# EAGLE schematic FindMeSAT_MB_1V2 (EAGLE 7.7.0)

## Sheet 1 of 12: CPU
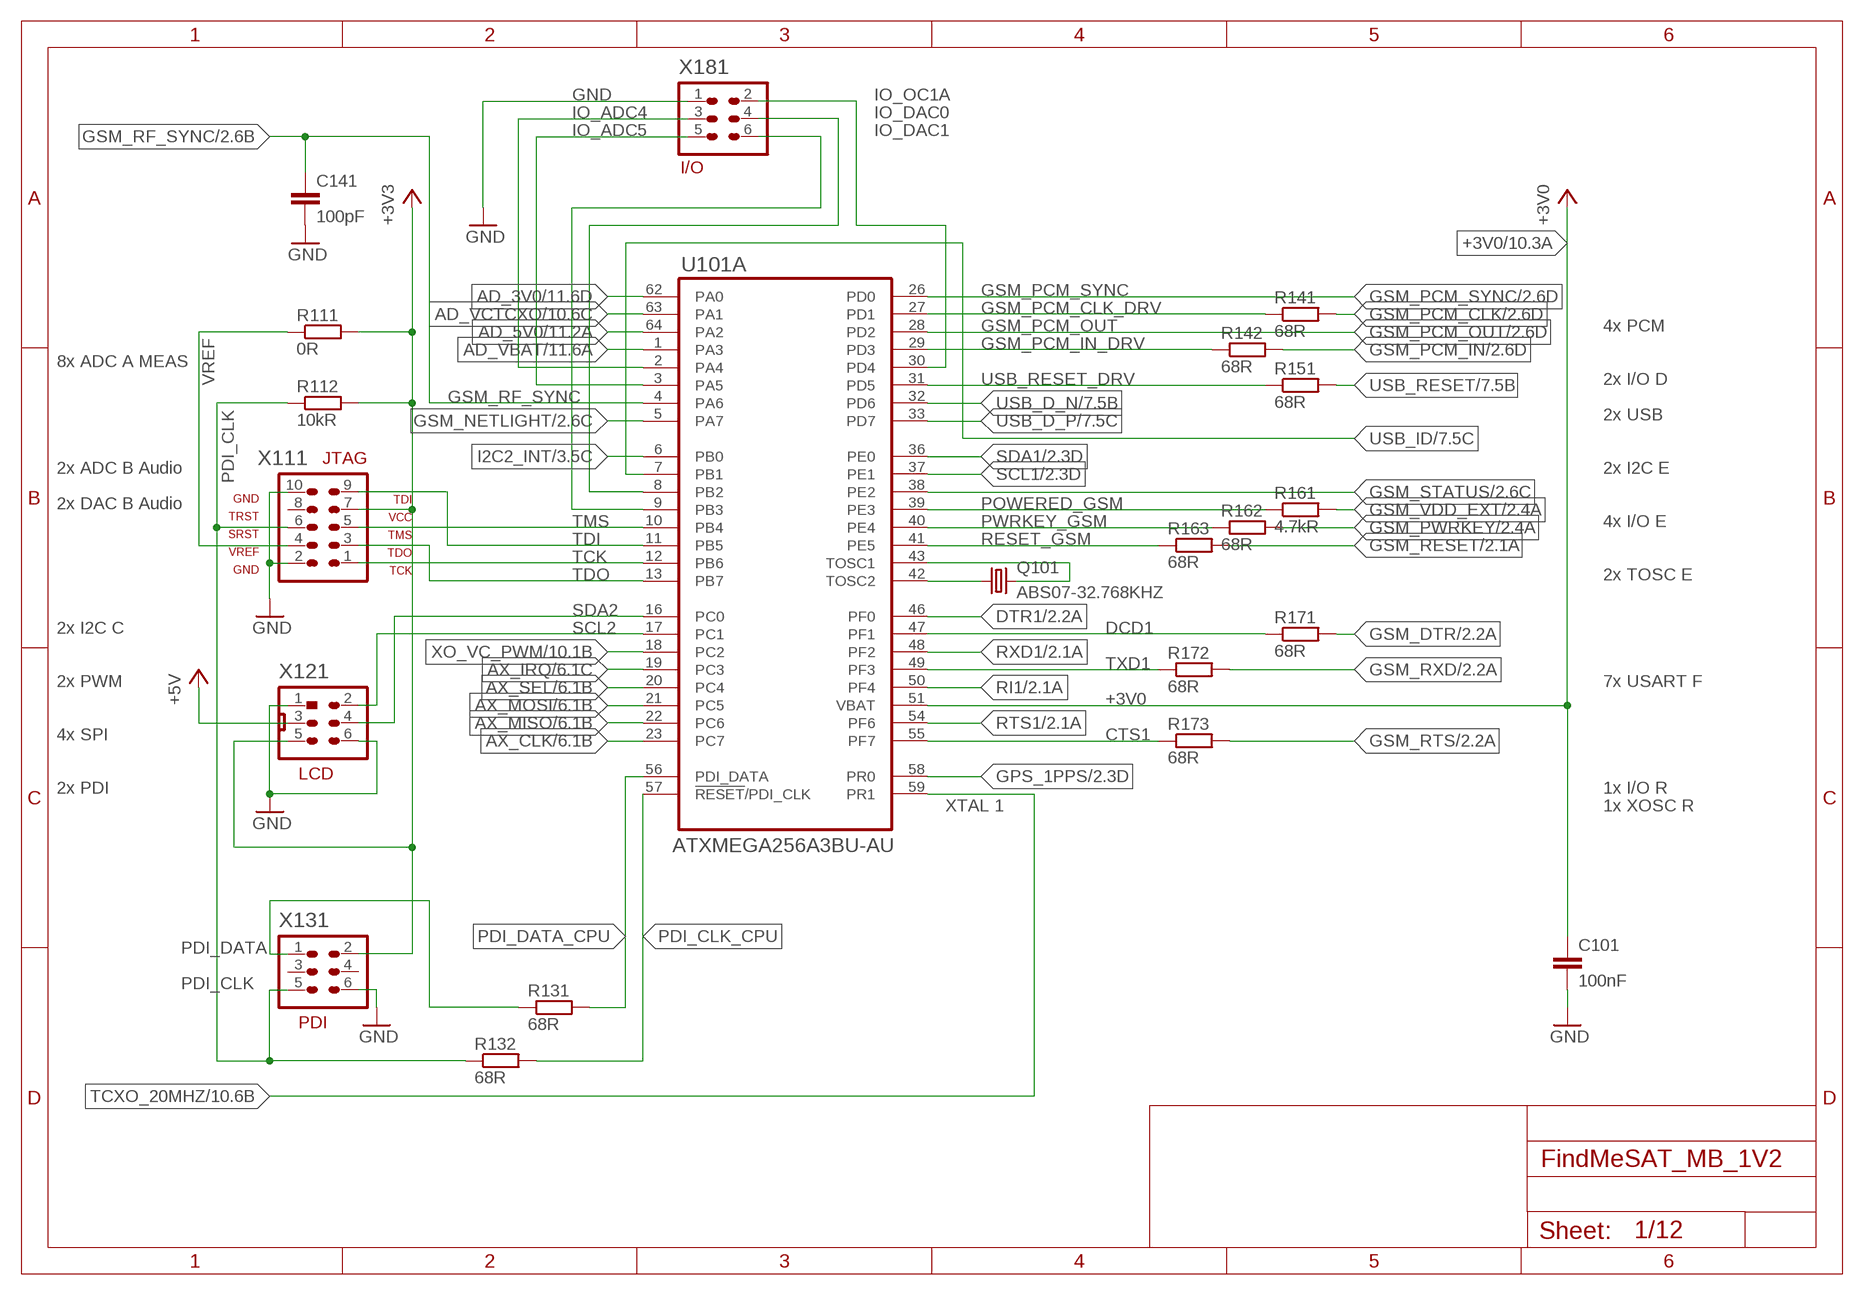
[diagram p0: schematic, sheet 1]

### Parts
C101  100nF  C-EUC0603  [C0603]
C141  100pF  C-EUC0603  [C0603]
Q101  ABS07-32.768KHZ  [ABS07]
R111  0R  R-EU_R0805  [R0805]
R112  10kR  R-EU_R0603  [R0603]
R131  68R  R-EU_R0603  [R0603]
R132  68R  R-EU_R0603  [R0603]
R141  68R  R-EU_R0603  [R0603]
R142  68R  R-EU_R0603  [R0603]
R151  68R  R-EU_R0603  [R0603]
R161  4.7kR  R-EU_R0603  [R0603]
R162  68R  R-EU_R0603  [R0603]
R163  68R  R-EU_R0603  [R0603]
R171  68R  R-EU_R0603  [R0603]
R172  68R  R-EU_R0603  [R0603]
R173  68R  R-EU_R0603  [R0603]
U101  ATXMEGA256A3BU-AU  [QFP80P1600X1600X120-64N]
X111  AVR-JTAG-10  [2X05]
X121  MOLEX_90130_2X03  [MOLEX_90130_2X03]
X131  HEADER-2X3  [2X03]
X181  HEADER-2X3  [2X03]

### Nets
+3V0: C101.1 U101.51(A:VBAT) ; also sheet 2,10,11
+3V3 [+3V3]: R111.2 R112.2 X111.7 X121.5 X131.2 ; also sheet 2,3,4,5,6,10,11
+5V [pwrA5]: X121.3 ; also sheet 2,7,11
AD_3V0: U101.62(A:PA0) ; also sheet 11
AD_5V0: U101.64(A:PA2) ; also sheet 11
AD_VBAT: U101.1(A:PA3) ; also sheet 11
AD_VCTCXO: U101.63(A:PA1) ; also sheet 10
AX_CLK [R110_SPI]: U101.23(A:PC7) ; also sheet 6
AX_IRQ [R110_SPI]: U101.19(A:PC3) ; also sheet 6
AX_MISO [R110_SPI]: U101.22(A:PC6) ; also sheet 6
AX_MOSI [R110_SPI]: U101.21(A:PC5) ; also sheet 6
AX_SEL [R110_SPI]: U101.20(A:PC4) ; also sheet 6
CTS1: R173.1 U101.55(A:PF7)
DCD1: R171.1 U101.47(A:PF1)
DTR1: U101.46(A:PF0) ; also sheet 2
GND [GND]: C101.2 C141.2 X111.2 X111.10 X121.1 X121.6 X131.6 X181.1 ; also sheet 2,3,4,5,6,7,8,9,10,11,12
GPS_1PPS: U101.58(A:PR0) ; also sheet 2
GSM_DTR: R171.2 ; also sheet 2
GSM_NETLIGHT: U101.5(A:PA7) ; also sheet 2
GSM_PCM_CLK: R141.2 ; also sheet 2
GSM_PCM_CLK_DRV: R141.1 U101.27(A:PD1)
GSM_PCM_IN: R142.2 ; also sheet 2
GSM_PCM_IN_DRV: R142.1 U101.29(A:PD3)
GSM_PCM_OUT: U101.28(A:PD2) ; also sheet 2
GSM_PCM_SYNC: U101.26(A:PD0) ; also sheet 2
GSM_PWRKEY: R162.2 ; also sheet 2
GSM_RESET: R163.2 ; also sheet 2
GSM_RF_SYNC: C141.1 U101.4(A:PA6) ; also sheet 2
GSM_RTS: R173.2 ; also sheet 2
GSM_RXD: R172.2 ; also sheet 2
GSM_STATUS: U101.38(A:PE2) ; also sheet 2
GSM_VDD_EXT: R161.2 ; also sheet 2
I2C2_INT: U101.6(A:PB0) ; also sheet 3
IO_ADC4: U101.2(A:PA4) X181.3
IO_ADC5: U101.3(A:PA5) X181.5
IO_DAC0: U101.8(A:PB2) X181.4
IO_DAC1: U101.9(A:PB3) X181.6
IO_OC1A: U101.30(A:PD4) X181.2
PDI_CLK: R112.1 R132.1 X111.6 X131.5
PDI_CLK_CPU: R132.2 U101.57(A:!RESET!/PDI_CLK)
PDI_DATA: R131.1 X131.1
PDI_DATA_CPU: R131.2 U101.56(A:PDI_DATA)
POWERED_GSM: R161.1 U101.39(A:PE3)
PWRKEY_GSM: R162.1 U101.40(A:PE4)
RESET_GSM: R163.1 U101.41(A:PE5)
RI1: U101.50(A:PF4) ; also sheet 2
RTS1: U101.54(A:PF6) ; also sheet 2
RXD1: U101.48(A:PF2) ; also sheet 2
SCL1: U101.37(A:PE1) ; also sheet 2,3,4,5
SCL2: U101.17(A:PC1) X121.2
SDA1: U101.36(A:PE0) ; also sheet 2,3,4,5
SDA2: U101.16(A:PC0) X121.4
TCK: U101.12(A:PB6) X111.1
TCXO_20MHZ: U101.59(A:PR1) ; also sheet 10
TDI: U101.11(A:PB5) X111.9
TDO: U101.13(A:PB7) X111.3
TMS: U101.10(A:PB4) X111.5
TOSC1: Q101.2 U101.43(A:TOSC1)
TOSC2: Q101.1 U101.42(A:TOSC2)
TXD1: R172.1 U101.49(A:PF3)
USB_D_N [R90_USB]: U101.32(A:PD6) ; also sheet 7
USB_D_P [R90_USB]: U101.33(A:PD7) ; also sheet 7
USB_ID: U101.7(A:PB1) ; also sheet 7
USB_RESET: R151.2 ; also sheet 7
USB_RESET_DRV: R151.1 U101.31(A:PD5)
VREF: R111.1 X111.4
XO_VC_PWM: U101.18(A:PC2) ; also sheet 10
Unconnected: X111.8 X131.3 X131.4

### Notes on the sheet
- I/O
- 4x PCM
- 8x ADC A MEAS
- 2x I/O D
- 2x USB
- 2x ADC B Audio | 2x I2C E
- 2x DAC B Audio
- 4x I/O E
- 2x TOSC E
- 2x I2C C
- 2x PWM | 7x USART F
- 4x SPI
- LCD
- 2x PDI | 1x I/O R
- XTAL 1 | 1x XOSC R
- PDI

## Sheet 2 of 12: GSM_GPS_BT
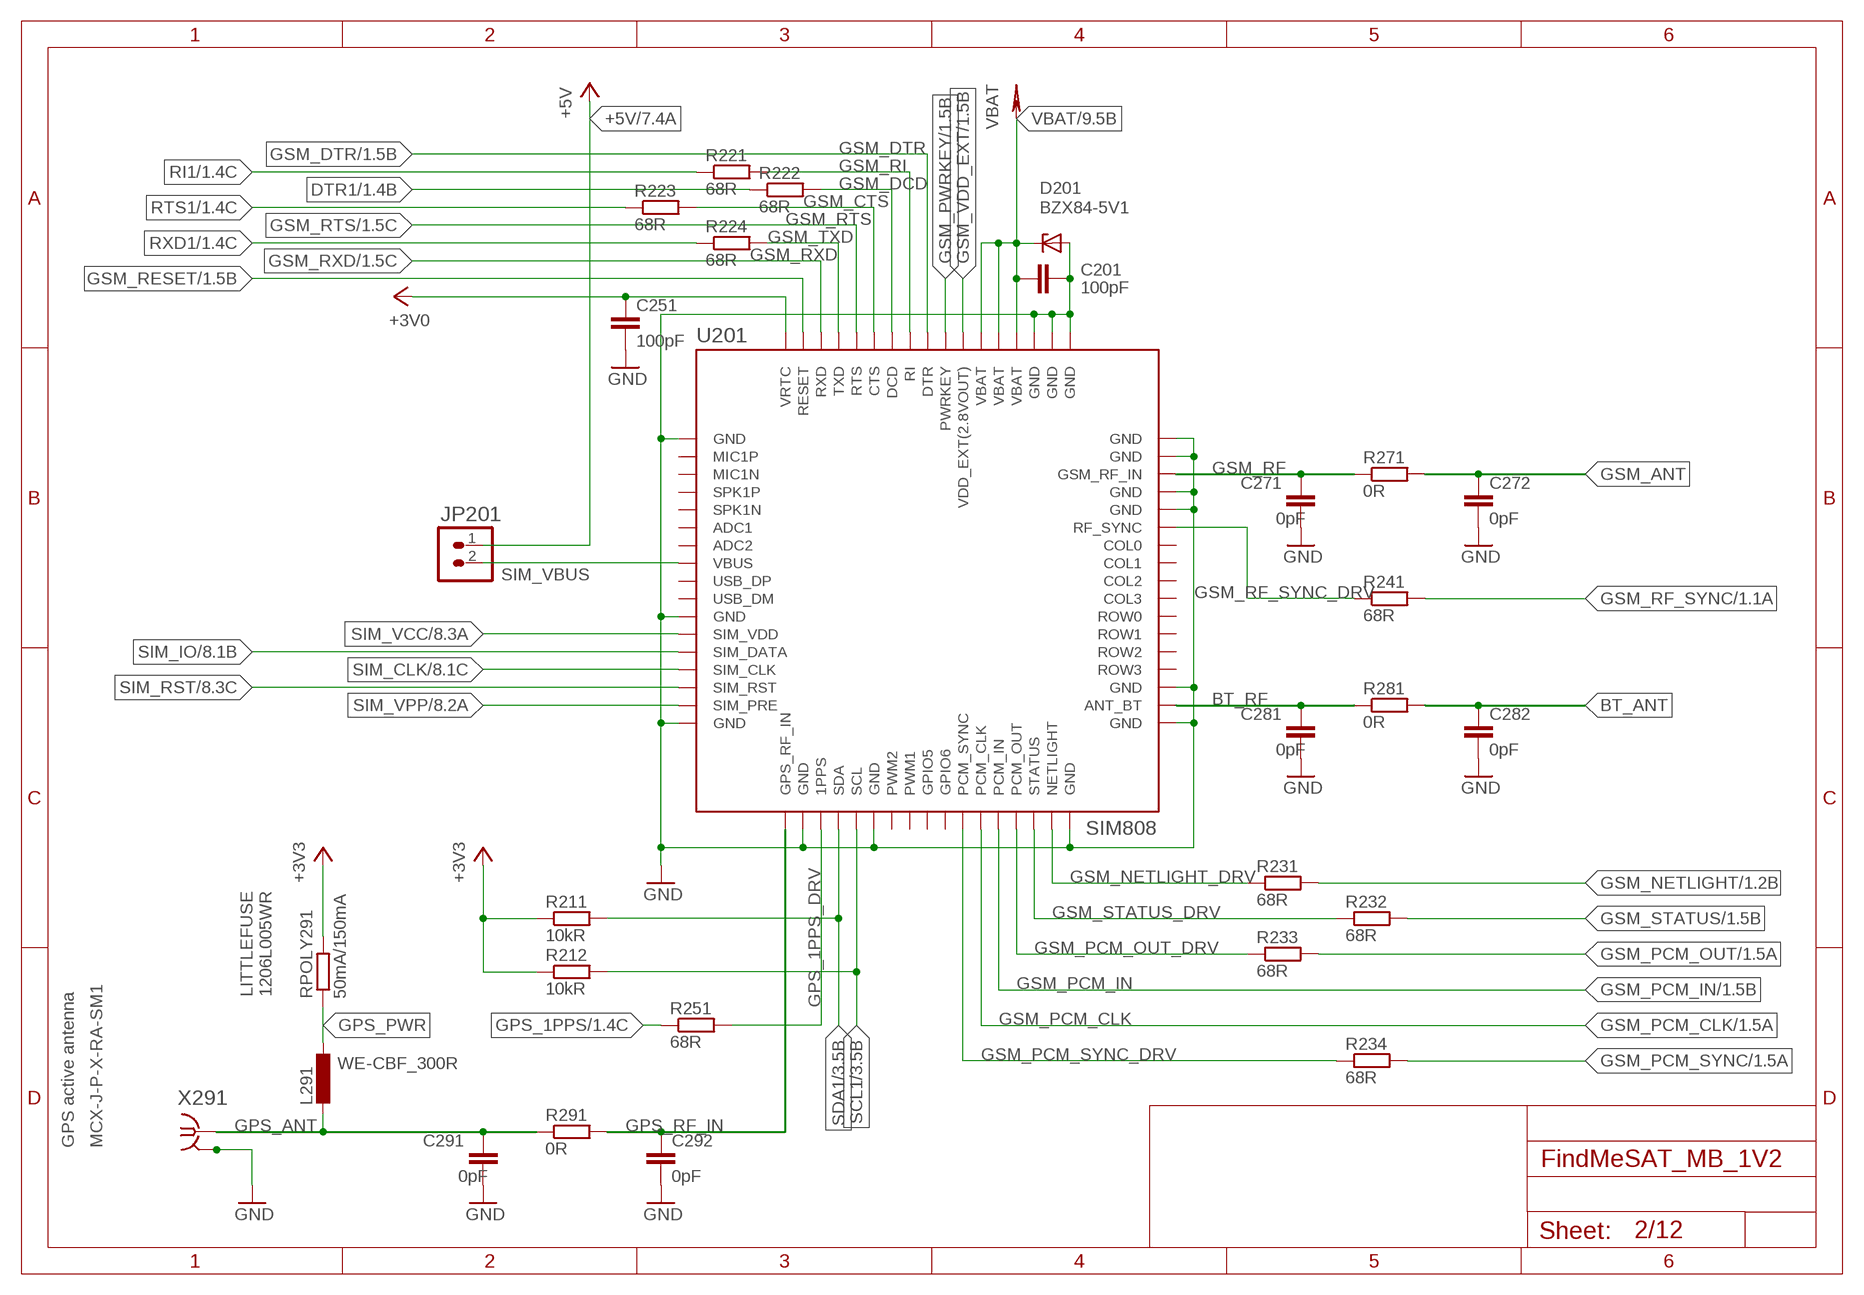
[diagram p1: schematic, sheet 2]

### Parts
C201  100pF  C-EUC0603  [C0603]
C251  100pF  C-EUC0603  [C0603]
C271  0pF  C-EUC0603  [C0603]
C272  0pF  C-EUC0603  [C0603]
C281  0pF  C-EUC0603  [C0603]
C282  0pF  C-EUC0603  [C0603]
C291  0pF  C-EUC0603  [C0603]
C292  0pF  C-EUC0603  [C0603]
D201  BZX84-5V1  BZX84CSMD  [TO236]
JP201  POW  HEADER-1X2  [1X02]
L291  WE-CBF_300R  L-EUL3216C  [L3216C]
R211  10kR  R-EU_R0603  [R0603]
R212  10kR  R-EU_R0603  [R0603]
R221  68R  R-EU_R0603  [R0603]
R222  68R  R-EU_R0603  [R0603]
R223  68R  R-EU_R0603  [R0603]
R224  68R  R-EU_R0603  [R0603]
R231  68R  R-EU_R0603  [R0603]
R232  68R  R-EU_R0603  [R0603]
R233  68R  R-EU_R0603  [R0603]
R234  68R  R-EU_R0603  [R0603]
R241  68R  R-EU_R0603  [R0603]
R251  68R  R-EU_R0603  [R0603]
R271  0R  R-EU_R0805  [R0805]
R281  0R  R-EU_R0805  [R0805]
R291  0R  R-EU_R0603  [R0603]
RPOLY291  50mA/150mA  R-EU_R1210  [R1210]
U201  SIM808  [SIM808]
X291  MCX-J-P-X-RA-SM1  [MCX-J-P-X-RA-SM1]

### Nets
+3V0: C251.1 U201.17(VRTC) ; also sheet 1,10,11
+3V3 [+3V3]: R211.1 R212.1 RPOLY291.2 ; also sheet 1,3,4,5,6,10,11
+5V [pwrA5]: JP201.1 ; also sheet 1,7,11
BT_ANT [R50]: C282.1 R281.2
BT_RF [R50]: C281.1 R281.1 U201.53(ANT_BT)
DTR1: R222.1 ; also sheet 1
GND [GND]: C201.2 C251.2 C271.2 C272.2 C281.2 C282.2 C291.2 C292.2 D201.A U201.1(GND) U201.2(GND) U201.3(GND) U201.18(GND) U201.28(GND) U201.34(GND) U201.36(GND) U201.40(GND) U201.51(GND) U201.52(GND) U201.54(GND) U201.64(GND) U201.65(GND) U201.67(GND) U201.68(GND) X291.2 X291.3 X291.4 X291.5 ; also sheet 1,3,4,5,6,7,8,9,10,11,12
GPS_1PPS: R251.1 ; also sheet 1
GPS_1PPS_DRV: R251.2 U201.37(1PPS)
GPS_ANT [R50]: C291.1 L291.2 R291.1 X291.1
GPS_PWR: L291.1 RPOLY291.1
GPS_RF_IN [R50]: C292.1 R291.2 U201.35(GPS_RF_IN)
GSM_ANT [R50]: C272.1 R271.2
GSM_CTS: R223.2 U201.12(CTS)
GSM_DCD: R222.2 U201.11(DCD)
GSM_DTR: U201.9(DTR) ; also sheet 1
GSM_NETLIGHT: R231.2 ; also sheet 1
GSM_NETLIGHT_DRV: R231.1 U201.50(NETLIGHT)
GSM_PCM_CLK: U201.46(PCM_CLK) ; also sheet 1
GSM_PCM_IN: U201.47(PCM_IN) ; also sheet 1
GSM_PCM_OUT: R233.2 ; also sheet 1
GSM_PCM_OUT_DRV: R233.1 U201.48(PCM_OUT)
GSM_PCM_SYNC: R234.2 ; also sheet 1
GSM_PCM_SYNC_DRV: R234.1 U201.45(PCM_SYNC)
GSM_PWRKEY: U201.8(PWRKEY) ; also sheet 1
GSM_RESET: U201.16(RESET) ; also sheet 1
GSM_RF [R50]: C271.1 R271.1 U201.66(GSM_RF_IN)
GSM_RF_SYNC: R241.2 ; also sheet 1
GSM_RF_SYNC_DRV: R241.1 U201.63(RF_SYNC)
GSM_RI: R221.2 U201.10(RI)
GSM_RTS: U201.13(RTS) ; also sheet 1
GSM_RXD: U201.15(RXD) ; also sheet 1
GSM_STATUS: R232.2 ; also sheet 1
GSM_STATUS_DRV: R232.1 U201.49(STATUS)
GSM_TXD: R224.2 U201.14(TXD)
GSM_VDD_EXT: U201.7(VDD_EXT(2.8VOUT)) ; also sheet 1
RI1: R221.1 ; also sheet 1
RTS1: R223.1 ; also sheet 1
RXD1: R224.1 ; also sheet 1
SCL1: R212.2 U201.39(SCL) ; also sheet 1,3,4,5
SDA1: R211.2 U201.38(SDA) ; also sheet 1,3,4,5
SIM_CLK: U201.31(SIM_CLK) ; also sheet 8
SIM_IO: U201.30(SIM_DATA) ; also sheet 8
SIM_RST: U201.32(SIM_RST) ; also sheet 8
SIM_VBUS: JP201.2 U201.25(VBUS)
SIM_VCC: U201.29(SIM_VDD) ; also sheet 8
SIM_VPP: U201.33(SIM_PRE) ; also sheet 8
VBAT [pwr2A]: C201.1 D201.C U201.4(VBAT) U201.5(VBAT) U201.6(VBAT) ; also sheet 9,11
Unconnected: U201.19(MIC1P) U201.20(MIC1N) U201.21(SPK1P) U201.22(SPK1N) U201.23(ADC1) U201.24(ADC2) U201.26(USB_DP) U201.27(USB_DM) U201.41(PWM2) U201.42(PWM1) U201.43(GPIO5) U201.44(GPIO6) U201.55(ROW3) U201.56(ROW2) U201.57(ROW1) U201.58(ROW0) U201.59(COL3) U201.60(COL2) U201.61(COL1) U201.62(COL0)

### Notes on the sheet
- LITTLEFUSE
  1206L005WR
- GPS active antenna

## Sheet 3 of 12: Gyro_Accel_Mag
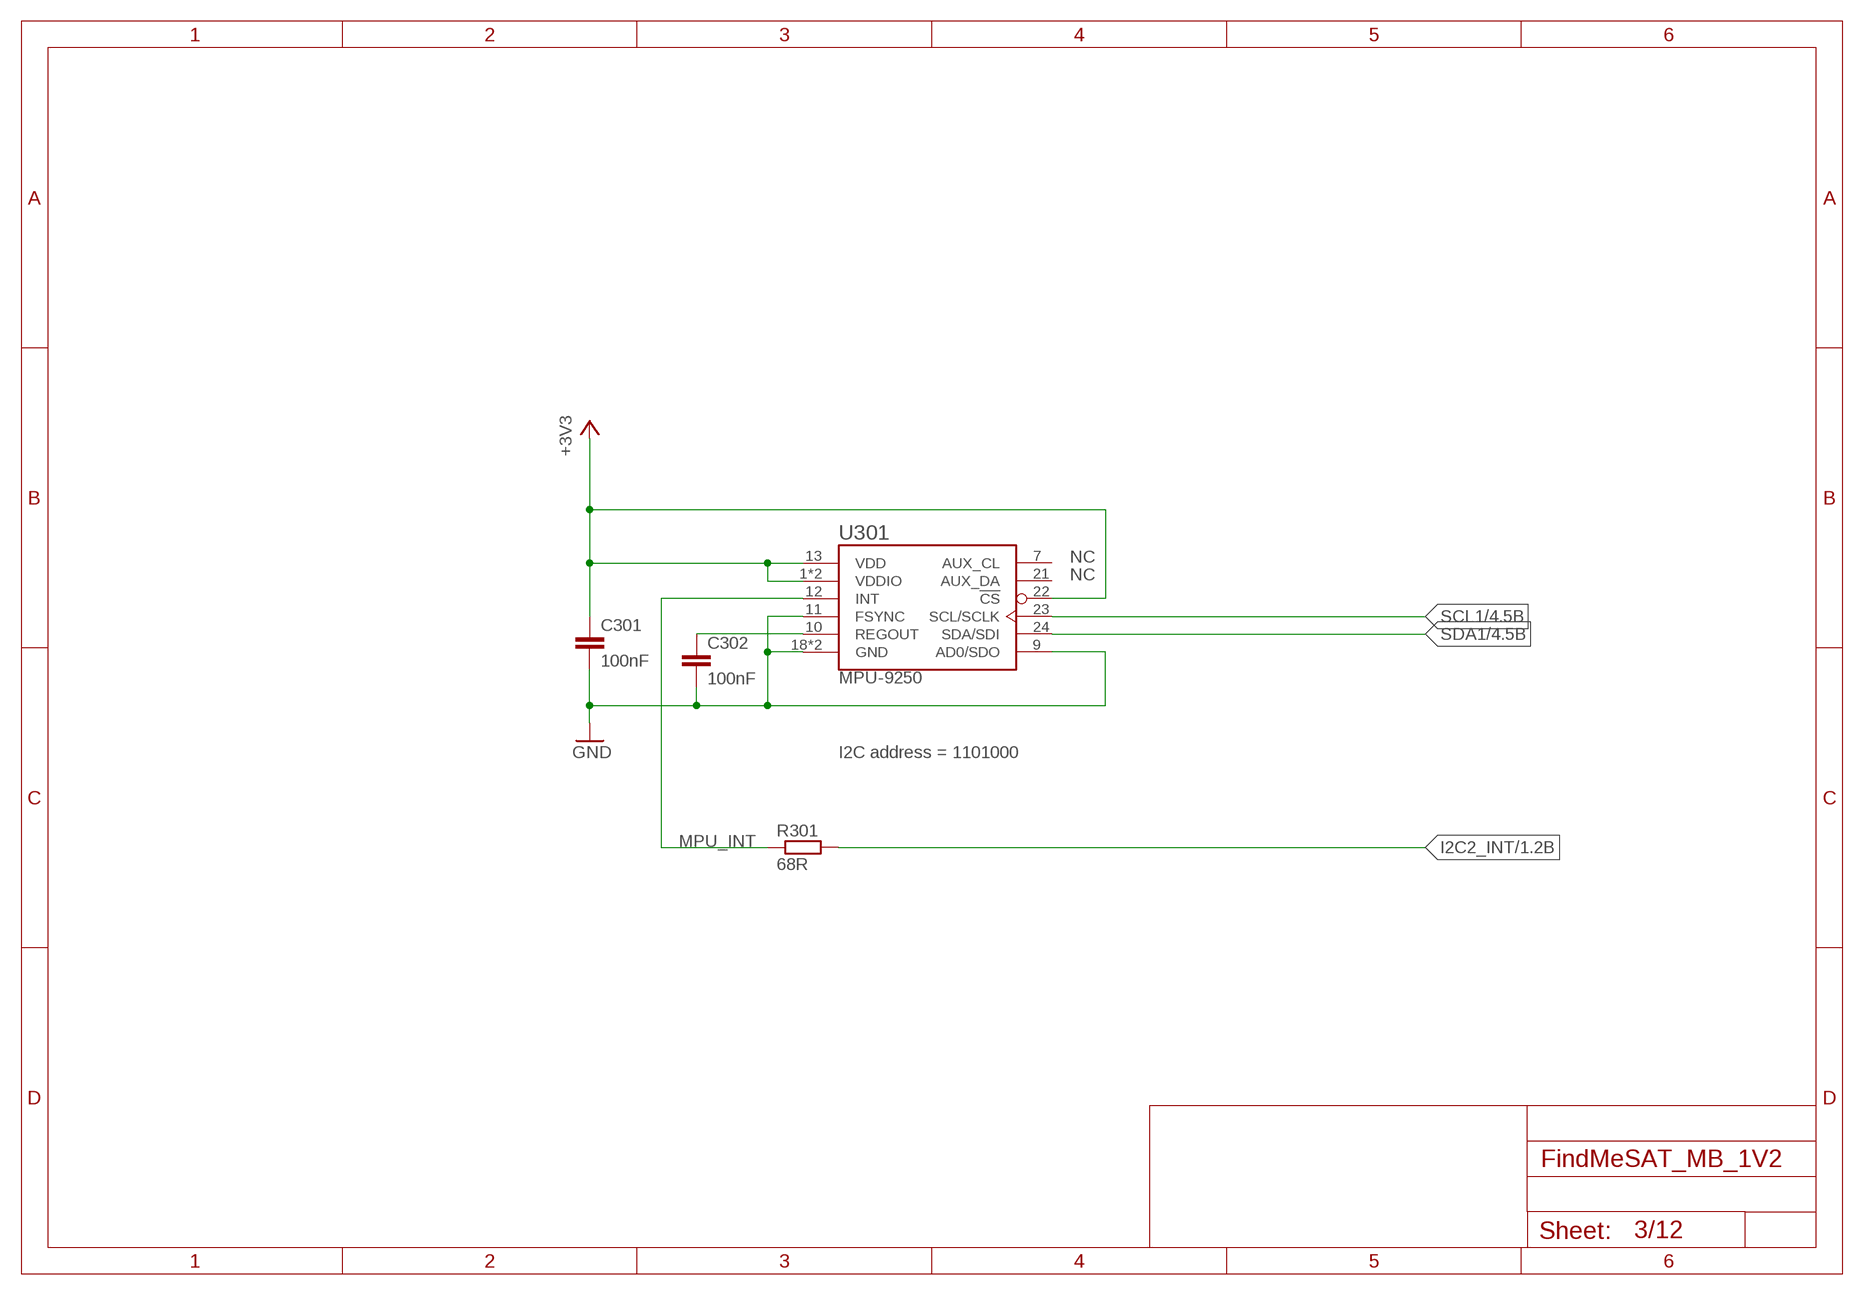
[diagram p2: schematic, sheet 3]

### Parts
C301  100nF  C-EUC0603  [C0603]
C302  100nF  C-EUC0603  [C0603]
R301  68R  R-EU_R0603  [R0603]
U301  MPU-9250  [QFN24-3X3]

### Nets
+3V3 [+3V3]: C301.1 U301.1(VDDIO) U301.8(VDDIO) U301.13(VDD) U301.22(!CS) ; also sheet 1,2,4,5,6,10,11
GAM_RO: C302.1 U301.10(REGOUT)
GND [GND]: C301.2 C302.2 U301.9(AD0/SDO) U301.11(FSYNC) U301.18(GND) U301.20(GND) ; also sheet 1,2,4,5,6,7,8,9,10,11,12
I2C2_INT: R301.2 ; also sheet 1
MPU_INT: R301.1 U301.12(INT)
SCL1: U301.23(SCL/SCLK) ; also sheet 1,2,4,5
SDA1: U301.24(SDA/SDI) ; also sheet 1,2,4,5
Unconnected: U301.7(AUX_CL) U301.21(AUX_DA)

### Notes on the sheet
- NC
- NC
- I2C address = 1101000

## Sheet 4 of 12: Baro_Temp
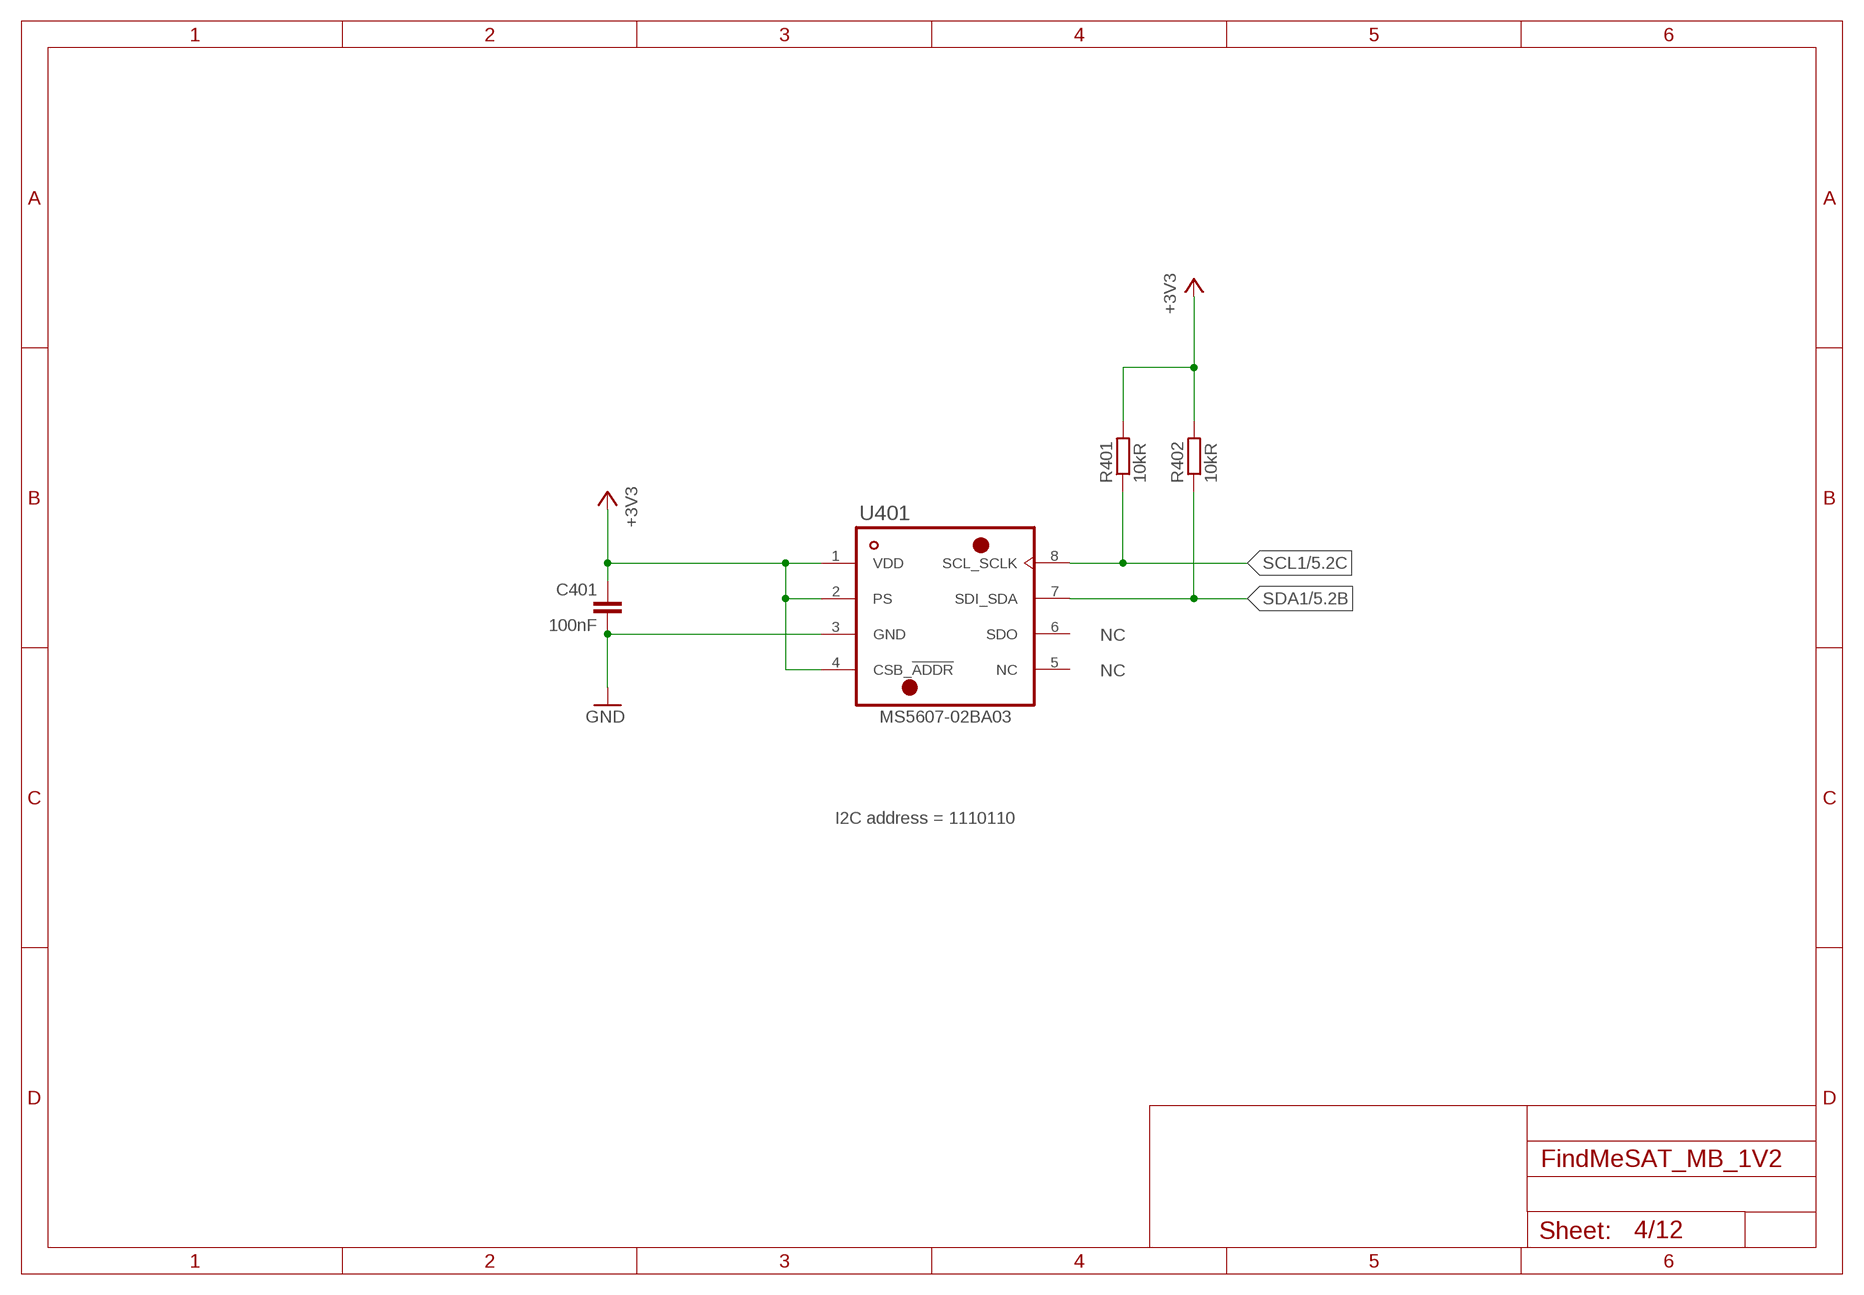
[diagram p3: schematic, sheet 4]

### Parts
C401  100nF  C-EUC0603  [C0603]
R401  10kR  R-EU_R0603  [R0603]
R402  10kR  R-EU_R0603  [R0603]
U401  MS5607-02BA03  [MS5607-02BA]

### Nets
+3V3 [+3V3]: C401.1 R401.2 R402.2 U401.1(VDD) U401.2(PS) U401.4(CSB_!ADDR) ; also sheet 1,2,3,5,6,10,11
GND [GND]: C401.2 U401.3(GND) ; also sheet 1,2,3,5,6,7,8,9,10,11,12
SCL1: R401.1 U401.8(SCL_SCLK) ; also sheet 1,2,3,5
SDA1: R402.1 U401.7(SDI_SDA) ; also sheet 1,2,3,5
Unconnected: U401.5(NC) U401.6(SDO)

### Notes on the sheet
- NC
- NC
- I2C address = 1110110

## Sheet 5 of 12: Hygro
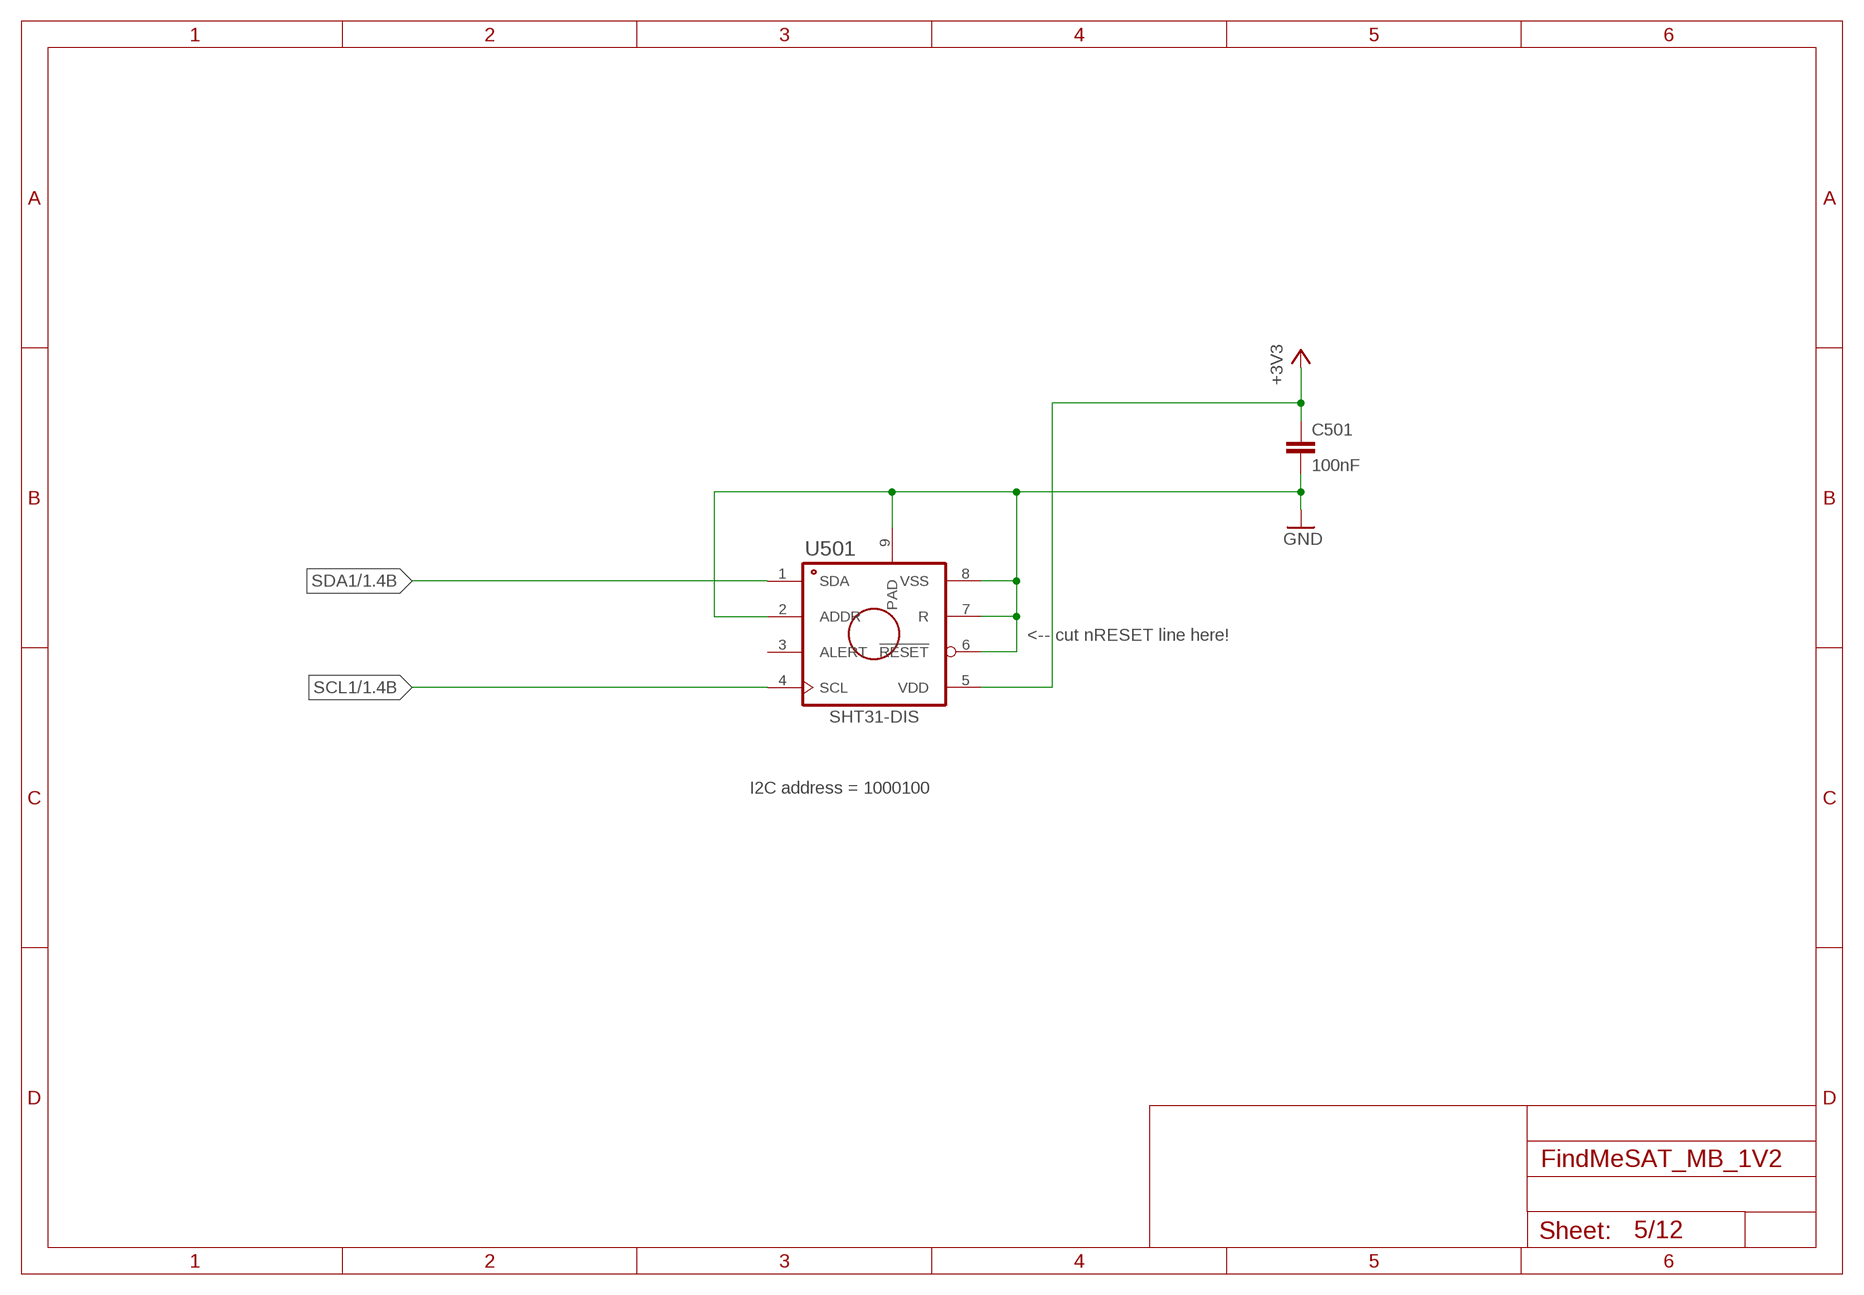
[diagram p4: schematic, sheet 5]

### Parts
C501  100nF  C-EUC0603  [C0603]
U501  SHT31-DIS  [DFN8/SHT]

### Nets
+3V3 [+3V3]: C501.1 U501.5(VDD) ; also sheet 1,2,3,4,6,10,11
GND [GND]: C501.2 U501.2(ADDR) U501.6(!RESET) U501.7(R) U501.8(VSS) U501.9(PAD) ; also sheet 1,2,3,4,6,7,8,9,10,11,12
SCL1: U501.4(SCL) ; also sheet 1,2,3,4
SDA1: U501.1(SDA) ; also sheet 1,2,3,4
Unconnected: U501.3(ALERT)

### Notes on the sheet
- <-- cut nRESET line here!
- I2C address = 1000100

## Sheet 6 of 12: VHF
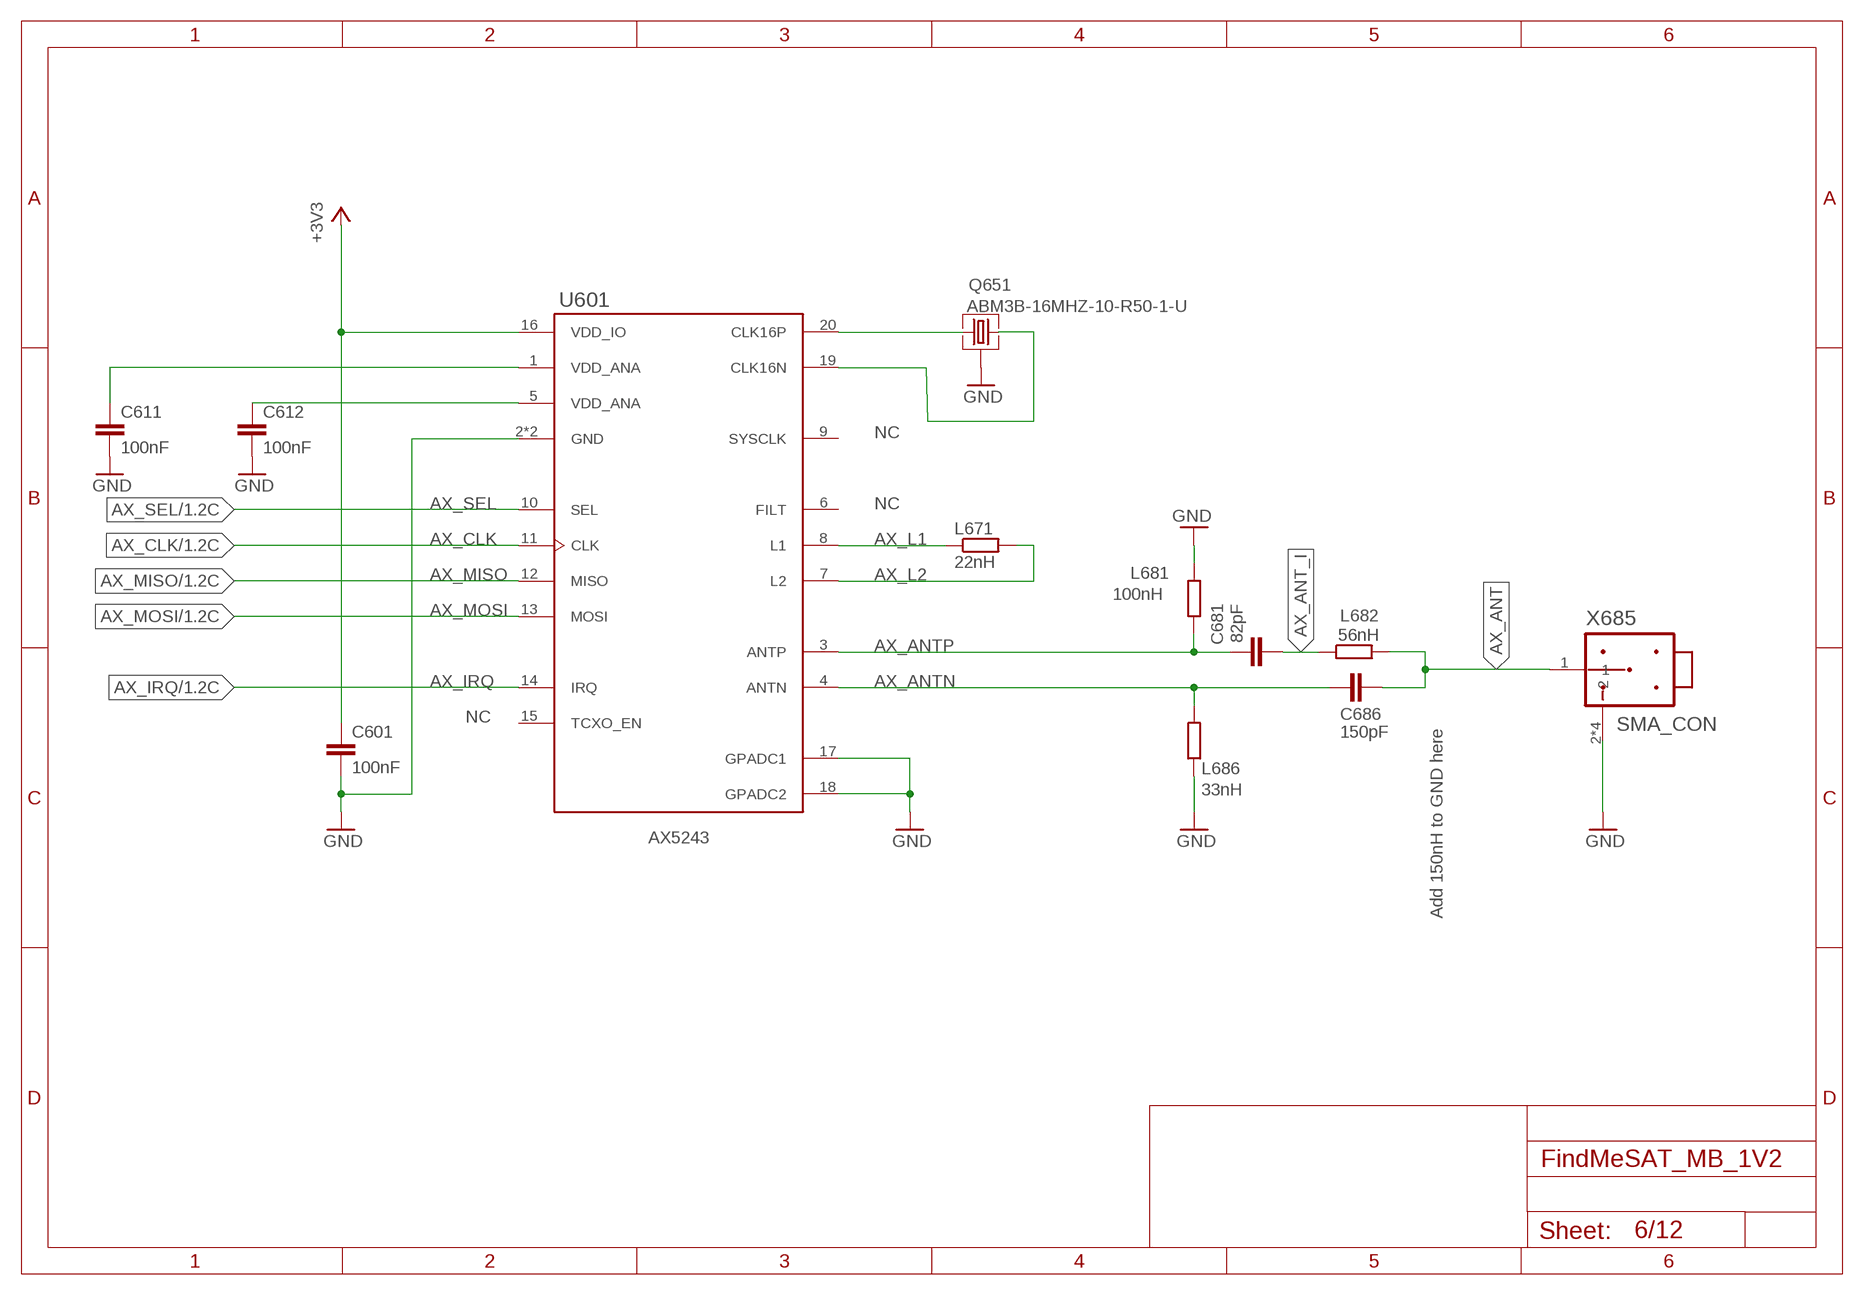
[diagram p5: schematic, sheet 6]

### Parts
C601  100nF  C-EUC0603  [C0603]
C611  100nF  C-EUC0603  [C0603]
C612  100nF  C-EUC0603  [C0603]
C681  82pF  C-EUC0603  [C0603]
C686  150pF  C-EUC0603  [C0603]
L671  22nH  R-EU_R0603  [R0603]
L681  100nH  R-EU_R0603  [R0603]
L682  56nH  R-EU_R0603  [R0603]
L686  33nH  R-EU_R0603  [R0603]
Q651  ABM3B-16MHZ-10-R50-1-U  ABM03B-16.000MHZ  [ABM03B]
U601  AX5243  [QFN20-4X4-0P5-PAD]
X685  SMA_CON  SMA_SMT_AMPHENOL-901-143  [SMA_SMT_AMPHENOL_901-143]

### Nets
+3V3 [+3V3]: C601.1 U601.16(VDD_IO) ; also sheet 1,2,3,4,5,10,11
AX_ANT [R50]: C686.2 L682.2 X685.1
AX_ANT_I [R50]: C681.2 L682.1
AX_ANTN [R50]: C686.1 L686.2 U601.4(ANTN)
AX_ANTP [R50]: C681.1 L681.1 U601.3(ANTP)
AX_CLK [R110_SPI]: U601.11(CLK) ; also sheet 1
AX_IRQ [R110_SPI]: U601.14(IRQ) ; also sheet 1
AX_L1: L671.1 U601.8(L1)
AX_L2: L671.2 U601.7(L2)
AX_MISO [R110_SPI]: U601.12(MISO) ; also sheet 1
AX_MOSI [R110_SPI]: U601.13(MOSI) ; also sheet 1
AX_SEL [R110_SPI]: U601.10(SEL) ; also sheet 1
CLK16N: Q651.3 U601.19(CLK16N)
CLK16P: Q651.1 U601.20(CLK16P)
GND [GND]: C601.2 C611.2 C612.2 L681.2 L686.1 Q651.2 Q651.4 U601.2(GND) U601.17(GPADC1) U601.18(GPADC2) U601.21(GND) X685.2 X685.3 X685.4 X685.5 ; also sheet 1,2,3,4,5,7,8,9,10,11,12
VDD_ANA@1: C611.1 U601.1(VDD_ANA)
VDD_ANA@5: C612.1 U601.5(VDD_ANA)
Unconnected: U601.6(FILT) U601.9(SYSCLK) U601.15(TCXO_EN)

### Notes on the sheet
- NC
- NC
- NC
- Add 150nH to GND here

## Sheet 7 of 12: USB
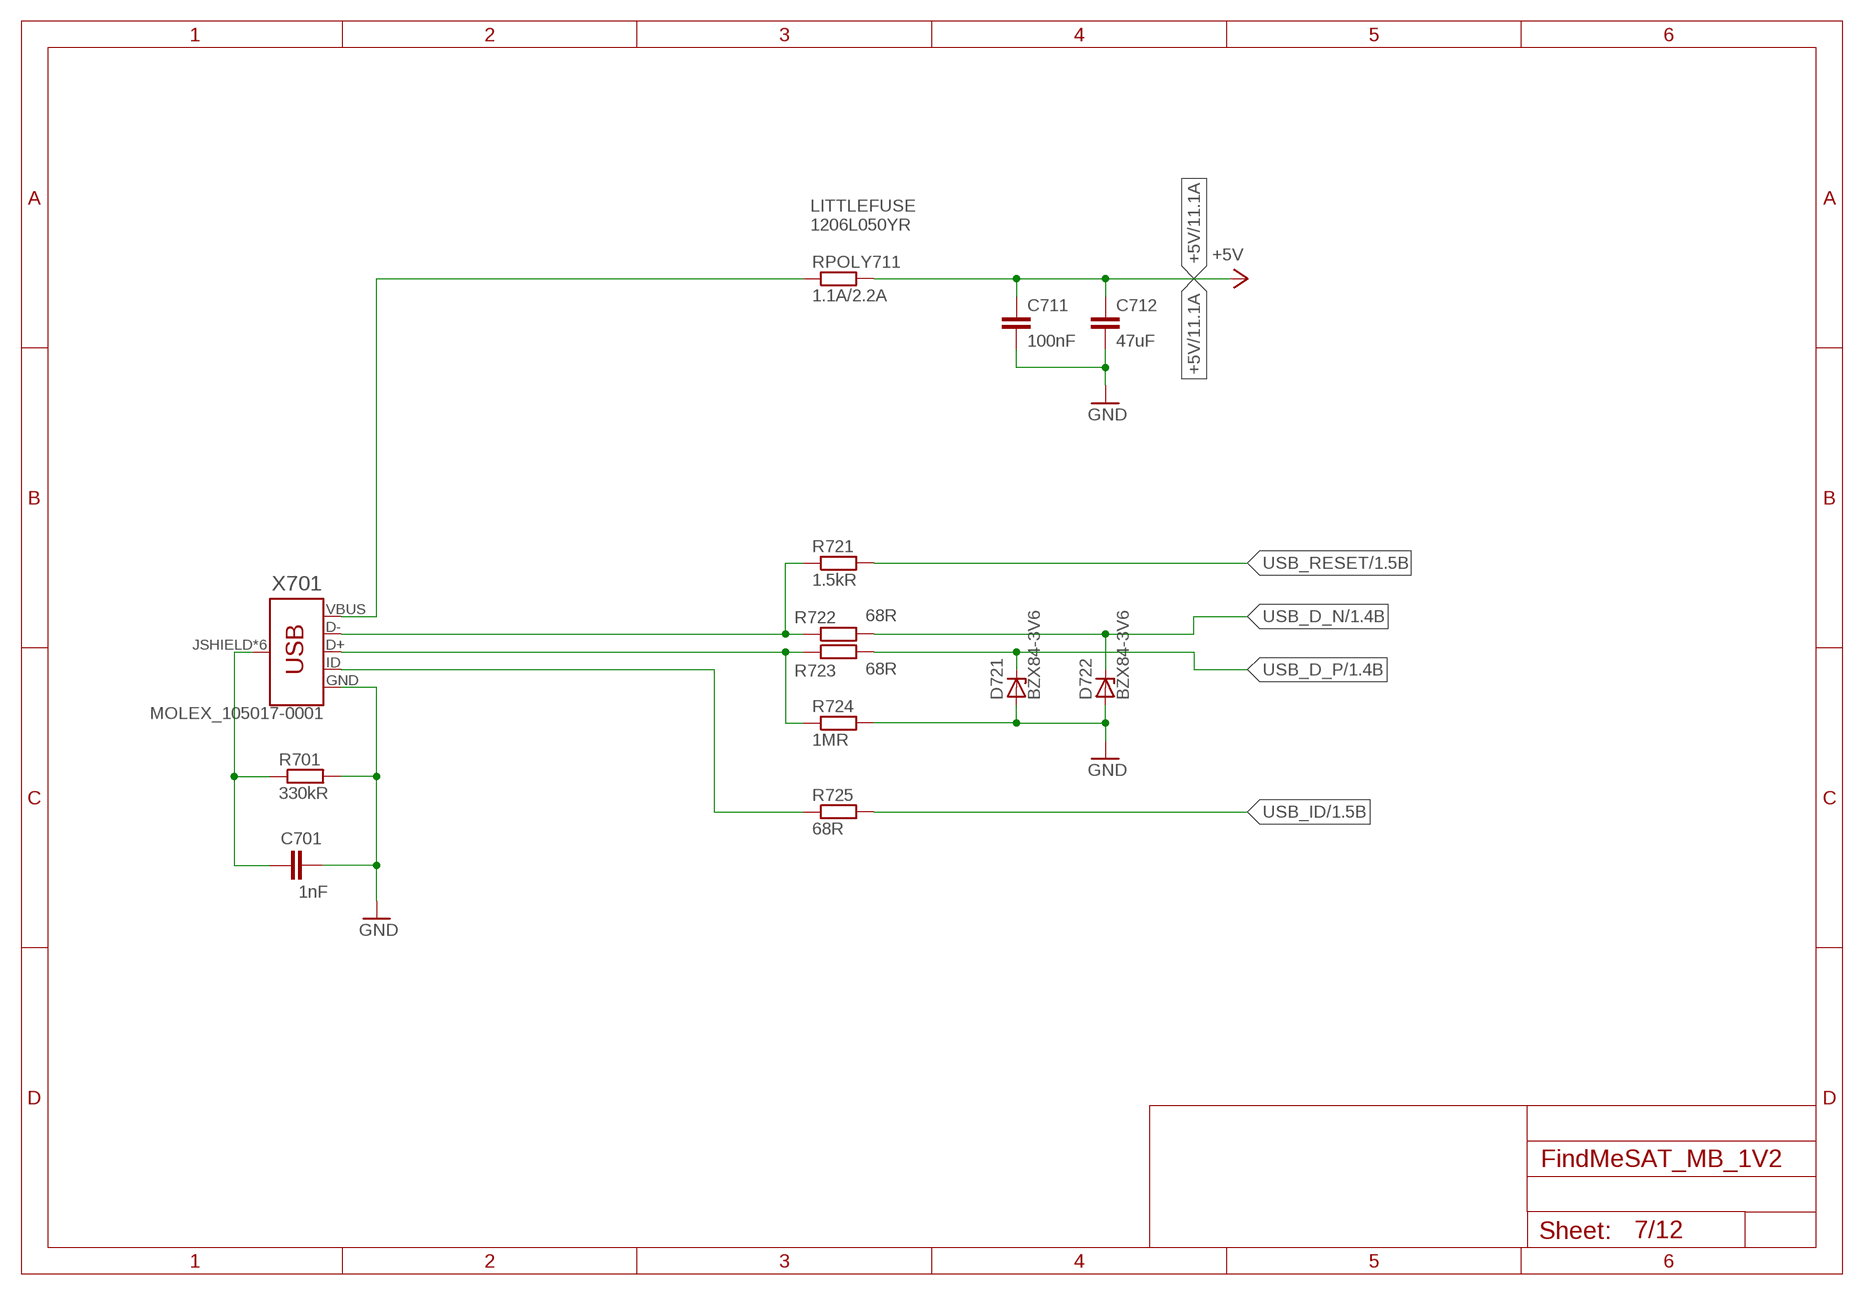
[diagram p6: schematic, sheet 7]

### Parts
C701  1nF  C-EUC0603  [C0603]
C711  100nF  C-EUC0603  [C0603]
C712  47uF  C-EUC0805  [C0805]
D721  BZX84-3V6  BZX84CSMD  [TO236]
D722  BZX84-3V6  BZX84CSMD  [TO236]
R701  330kR  R-EU_R0603  [R0603]
R721  1.5kR  R-EU_R0603  [R0603]
R722  68R  R-EU_R0603  [R0603]
R723  68R  R-EU_R0603  [R0603]
R724  1MR  R-EU_R0603  [R0603]
R725  68R  R-EU_R0603  [R0603]
RPOLY711  1.1A/2.2A  R-EU_M1206  [M1206]
X701  MOLEX_105017-0001  USB_MICRO-B_MOLEX  [USB-B-MICRO-SMD_MOLEX-105017-0001]

### Nets
+5V [pwrA5]: C711.1 C712.1 RPOLY711.2 ; also sheet 1,2,11
GND [GND]: C701.2 C711.2 C712.2 D721.A D722.A R701.2 R724.2 X701.GND ; also sheet 1,2,3,4,5,6,8,9,10,11,12
J_D+: R723.1 R724.1 X701.D+(J_D+)
J_D-: R721.1 R722.1 X701.D-(J_D-)
J_ID: R725.1 X701.ID(J_ID)
J_SHIELD: C701.1 R701.1 X701.JSHIELD(SHIELD) X701.JSHIELD@2(SHIELD) X701.JSHIELD@3(SHIELD) X701.JSHIELD@4(SHIELD) X701.JSHIELD@5(SHIELD) X701.JSHIELD@6(SHIELD)
J_VUSB [pwrA5]: RPOLY711.1 X701.VBUS(J_VUSB)
USB_D_N [R90_USB]: D722.C R722.2 ; also sheet 1
USB_D_P [R90_USB]: D721.C R723.2 ; also sheet 1
USB_ID: R725.2 ; also sheet 1
USB_RESET: R721.2 ; also sheet 1

### Notes on the sheet
- LITTLEFUSE
  1206L050YR

## Sheet 8 of 12: Micro-SIM_cardholder
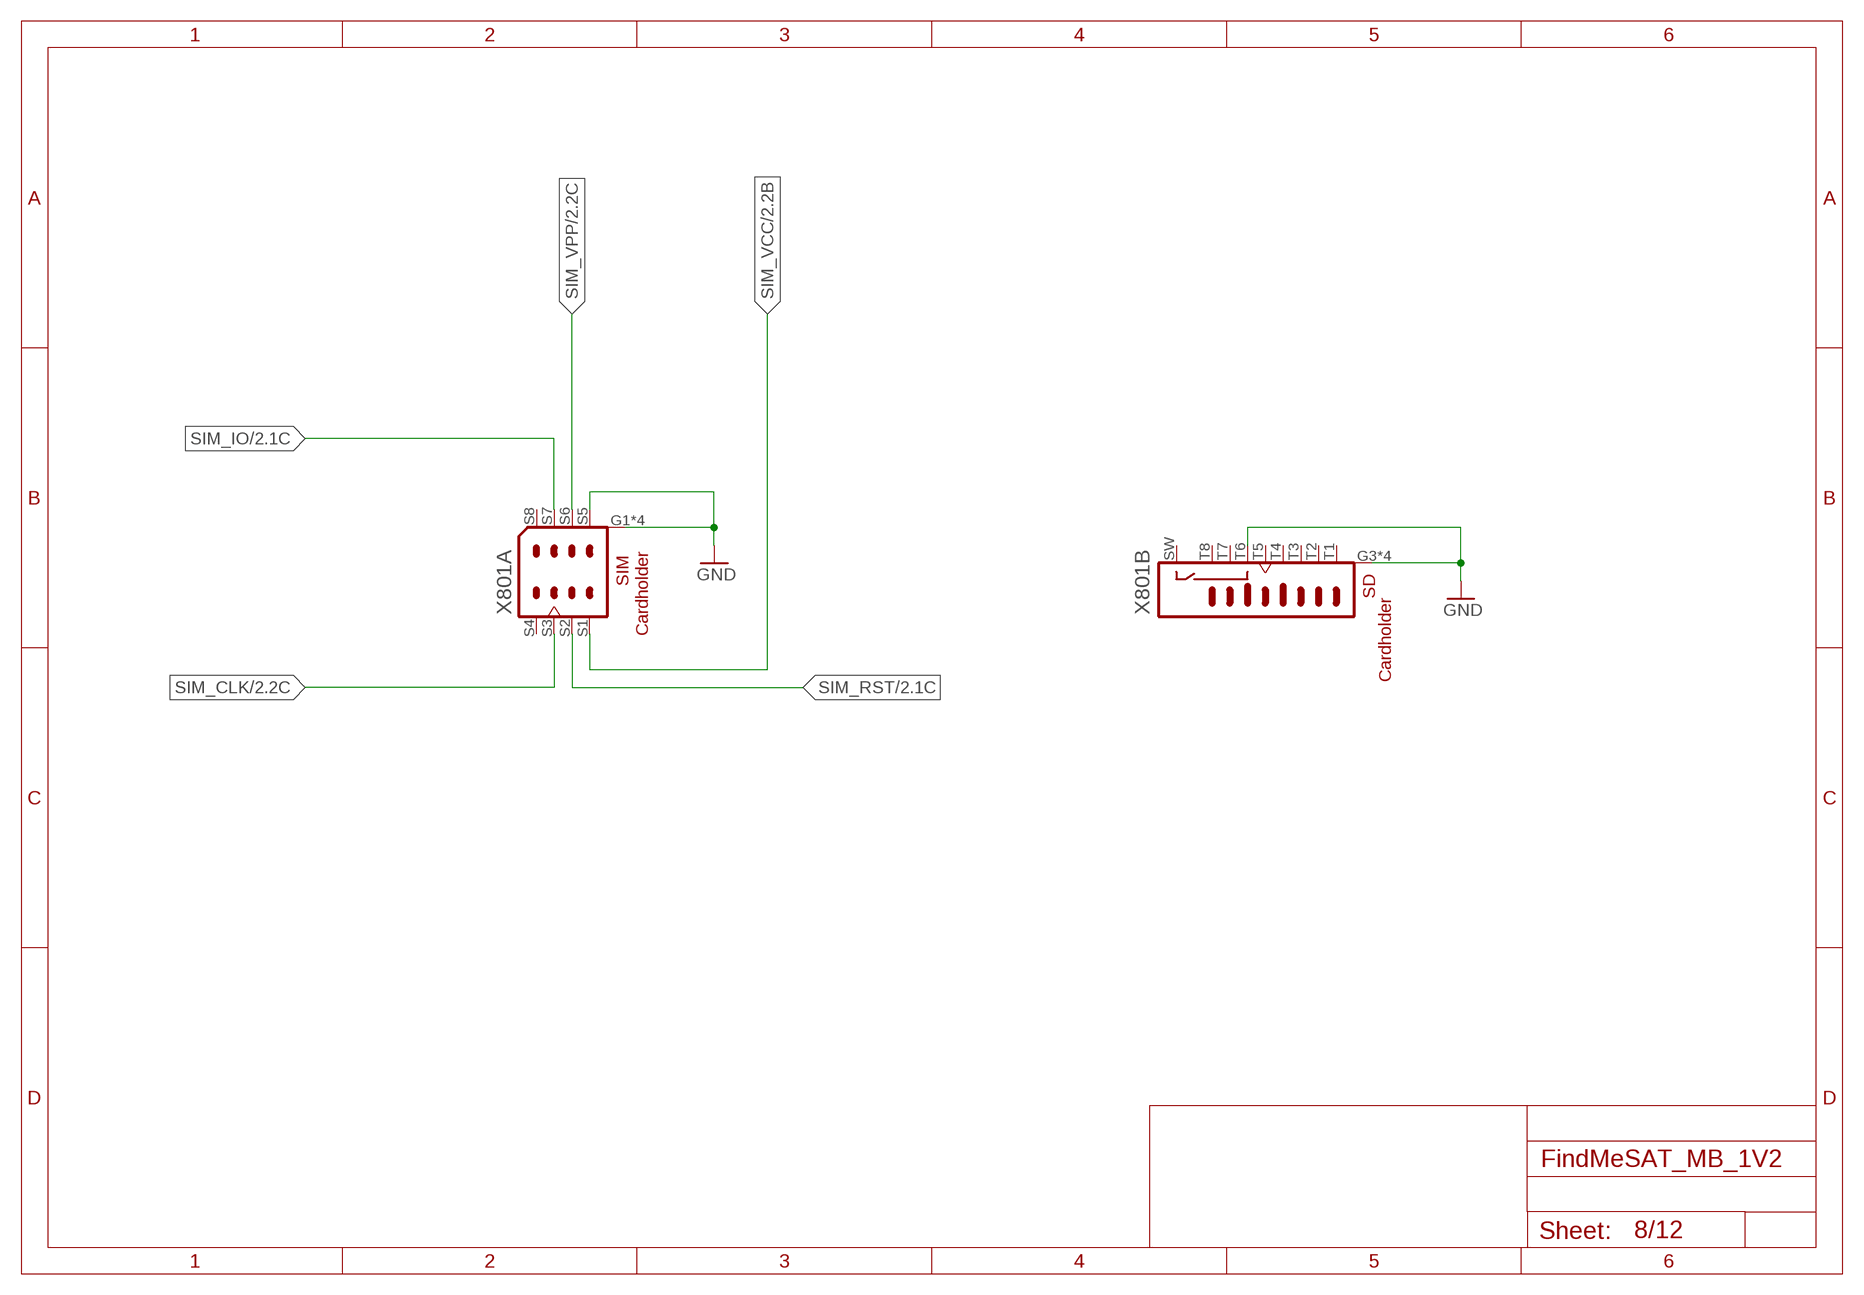
[diagram p7: schematic, sheet 8]

### Parts
X801  MICROSIM-8P_SDCARD-8P_MOLEX-104642-1610  [MICROSIM-8P_SDCARD-8P_MOLEX-104642-1610]

### Nets
GND [GND]: X801.G1(A:SHIELD) X801.G2(A:SHIELD) X801.G3(B:SHIELD) X801.G4(B:SHIELD) X801.G5(B:SHIELD) X801.G6(B:SHIELD) X801.G7(A:SHIELD) X801.G8(A:SHIELD) X801.S5(A:S5) X801.T6(B:T6) ; also sheet 1,2,3,4,5,6,7,9,10,11,12
SIM_CLK: X801.S3(A:S3) ; also sheet 2
SIM_IO: X801.S7(A:S7) ; also sheet 2
SIM_RST: X801.S2(A:S2) ; also sheet 2
SIM_VCC: X801.S1(A:S1) ; also sheet 2
SIM_VPP: X801.S6(A:S6) ; also sheet 2
Unconnected: X801.S4(A:S4) X801.S8(A:S8) X801.SW(B:SW) X801.T1(B:T1) X801.T2(B:T2) X801.T3(B:T3) X801.T5(B:T5) X801.T7(B:T7) X801.T8(B:T8)

## Sheet 9 of 12: BatteryConnector
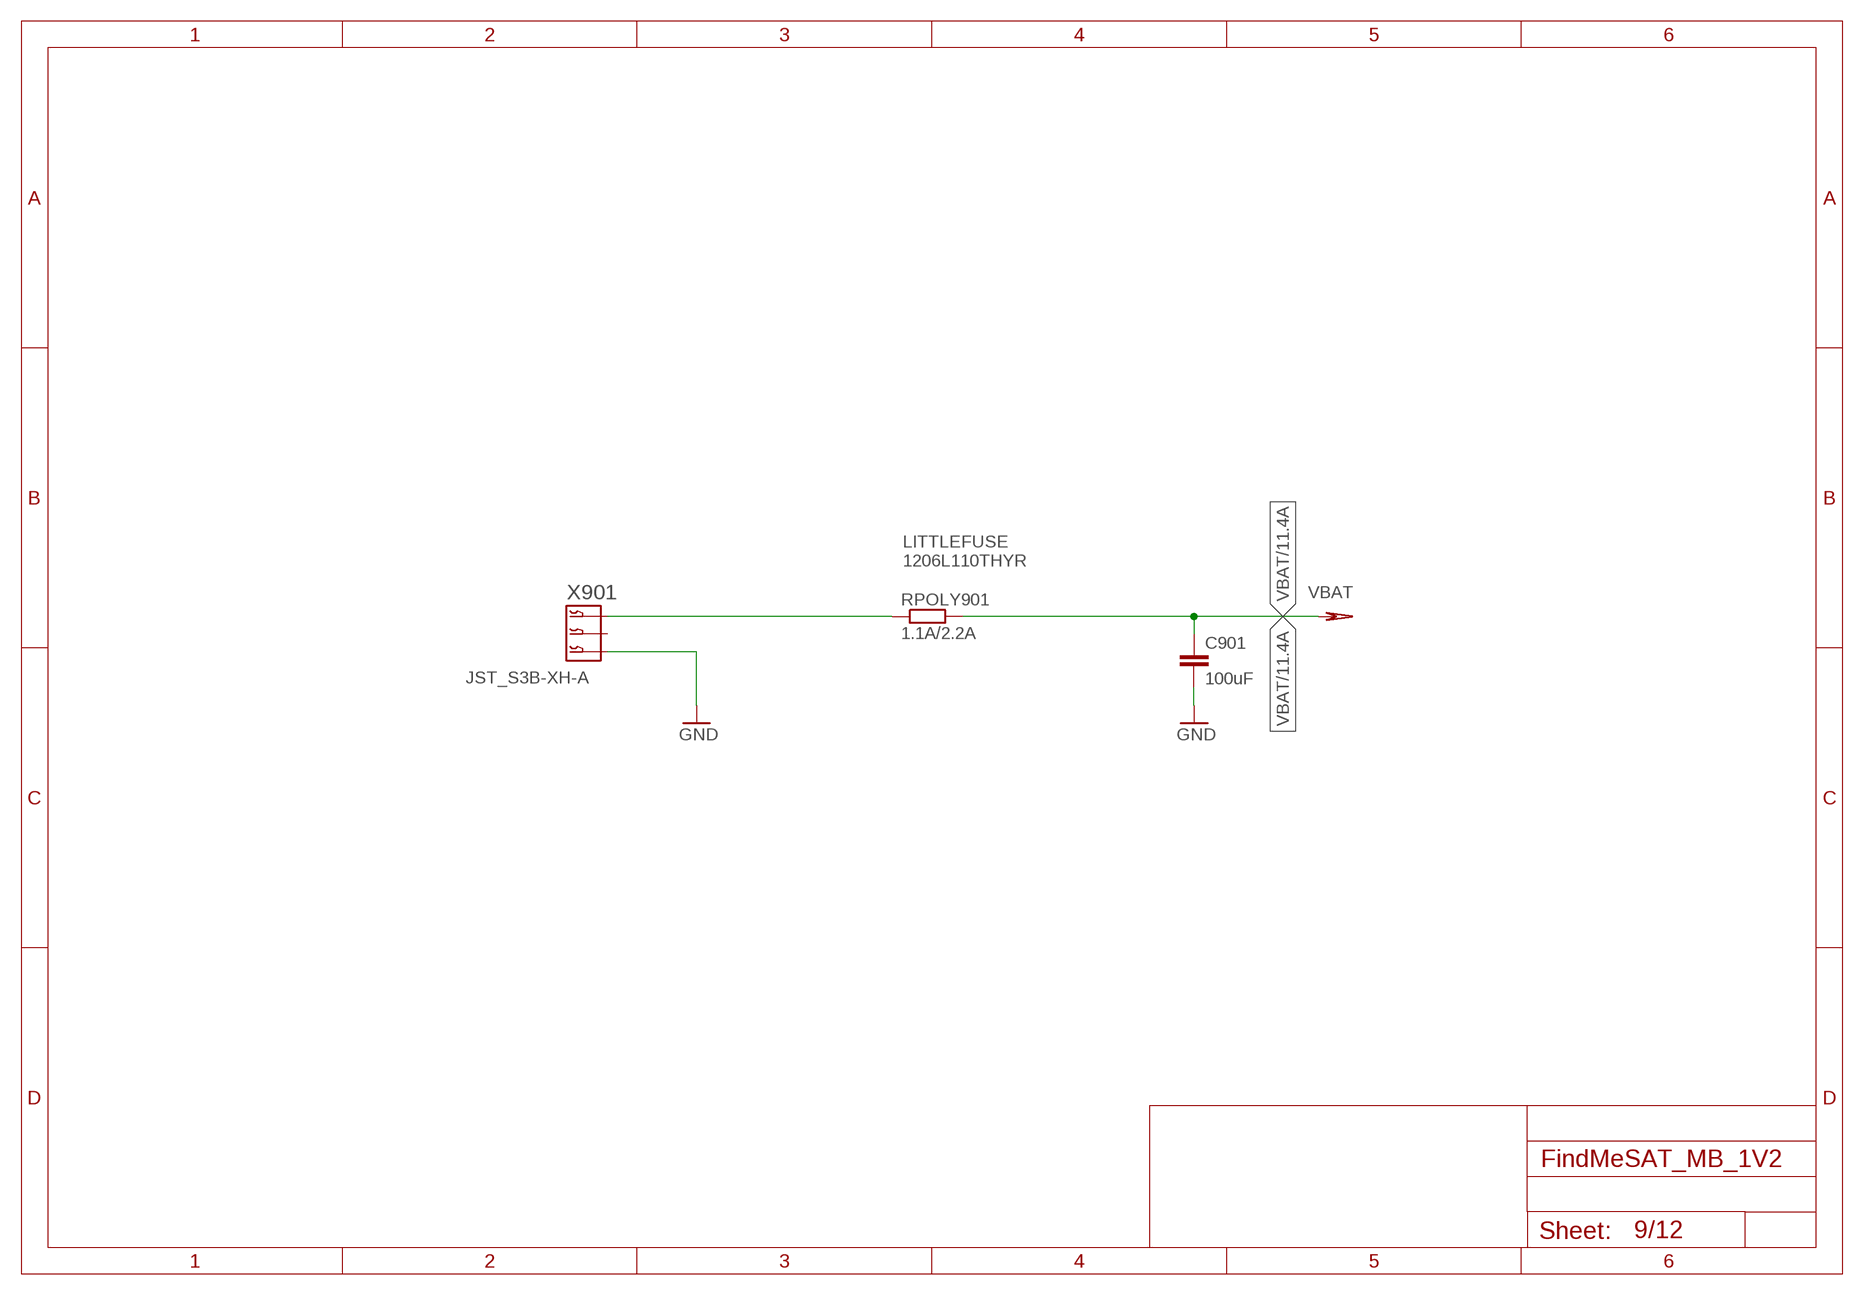
[diagram p8: schematic, sheet 9]

### Parts
C901  100uF  C-EUC0805  [C0805]
RPOLY901  1.1A/2.2A  R-EU_M1206  [M1206]
X901  JST_S3B-XH-A  [JST_S3B-XH-A]

### Nets
BATTERY: RPOLY901.1 X901.1
GND [GND]: C901.2 X901.3 ; also sheet 1,2,3,4,5,6,7,8,10,11,12
VBAT [pwr2A]: C901.1 RPOLY901.2 ; also sheet 2,11
Unconnected: X901.2

### Notes on the sheet
- LITTLEFUSE
  1206L110THYR

## Sheet 10 of 12: VCTCXO
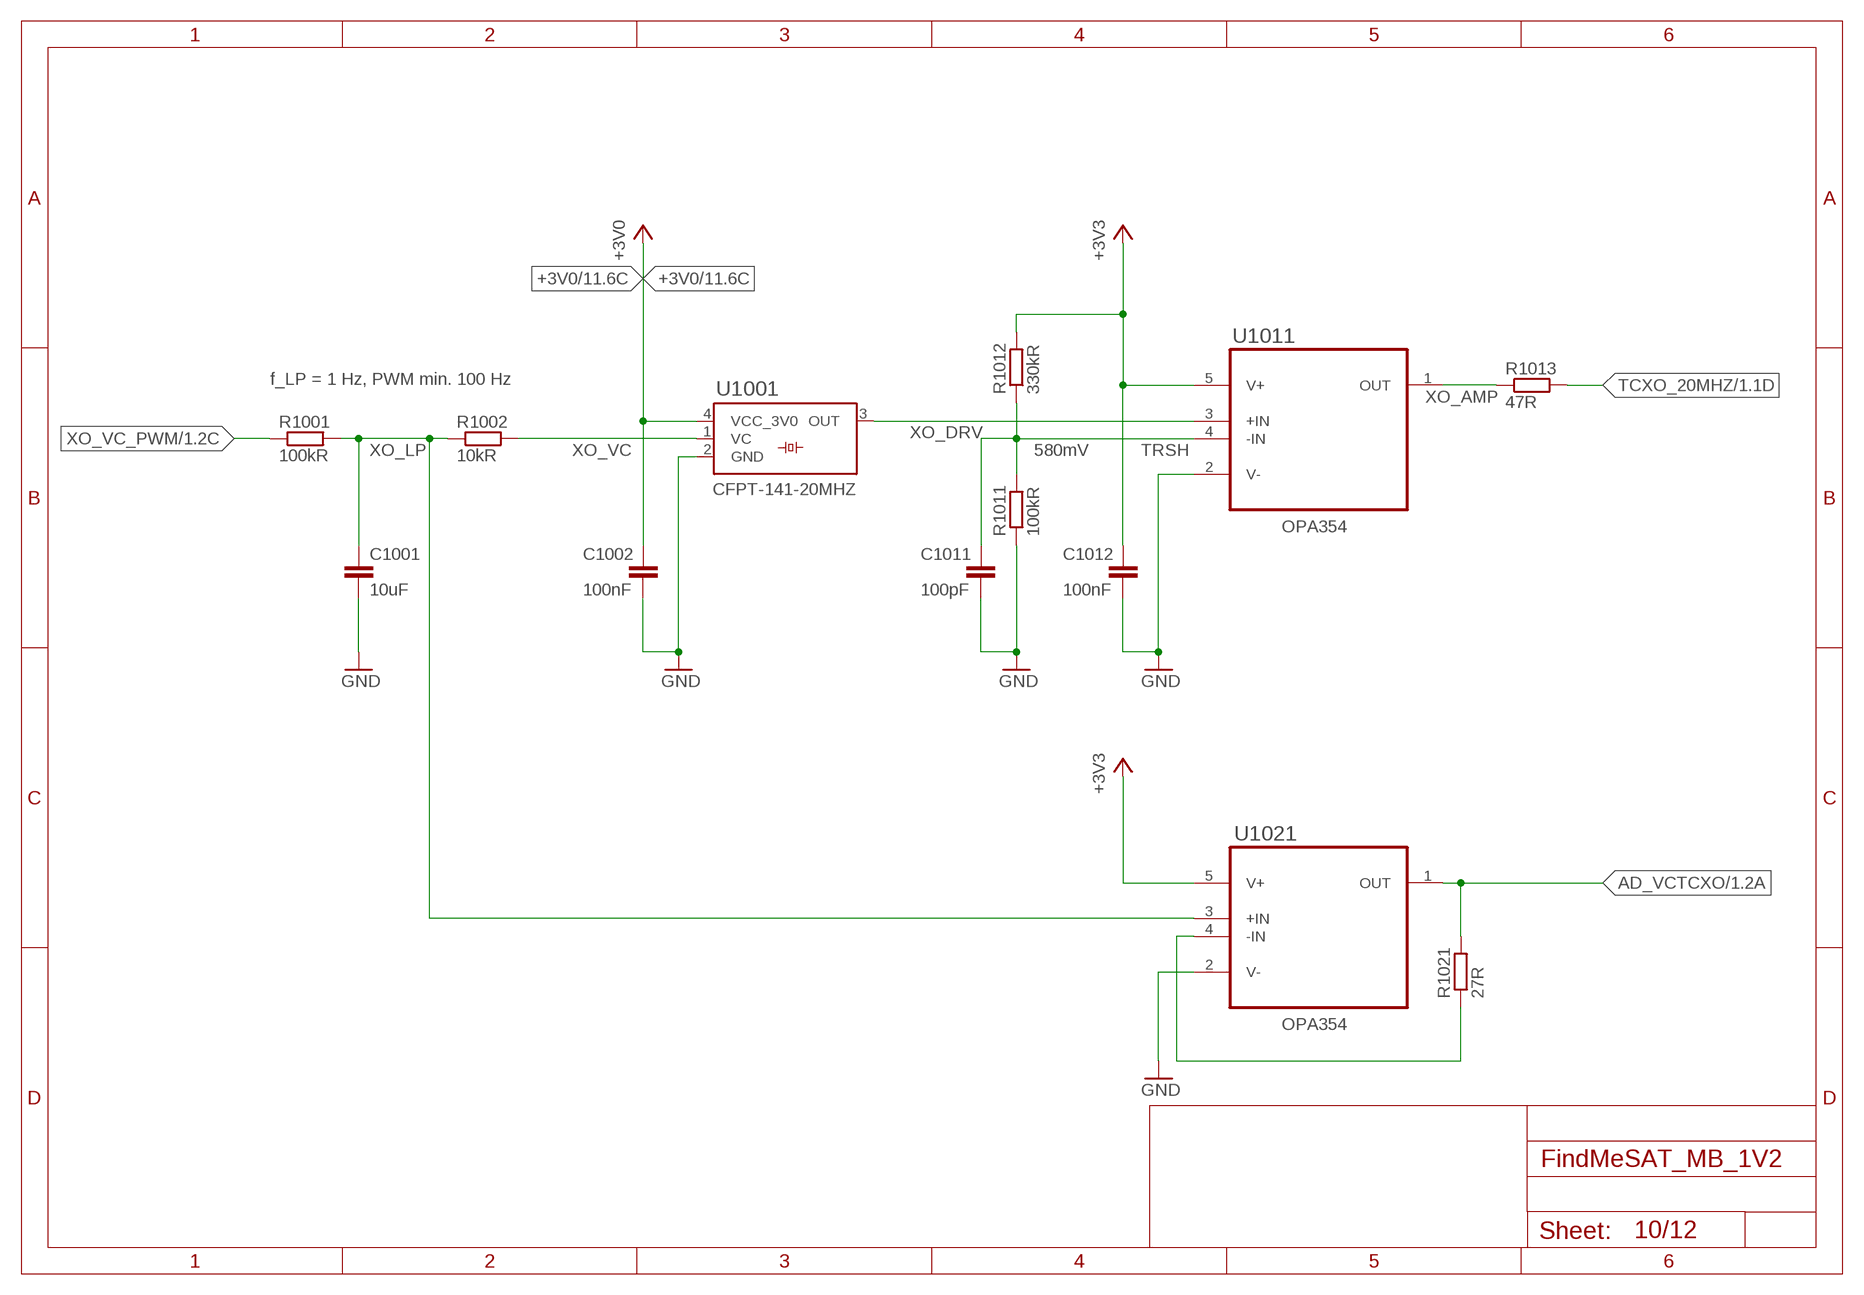
[diagram p9: schematic, sheet 10]

### Parts
C1001  10uF  C-EUC0603  [C0603]
C1002  100nF  C-EUC0603  [C0603]
C1011  100pF  C-EUC0603  [C0603]
C1012  100nF  C-EUC0603  [C0603]
R1001  100kR  R-EU_R0603  [R0603]
R1002  10kR  R-EU_R0603  [R0603]
R1011  100kR  R-EU_R0603  [R0603]
R1012  330kR  R-EU_R0603  [R0603]
R1013  47R  R-EU_R0603  [R0603]
R1021  27R  R-EU_R0603  [R0603]
U1001  CFPT-141-20MHZ  [CFPT-141]
U1011  OPA354  [SOT-23-5]
U1021  OPA354  [SOT-23-5]

### Nets
+3V0: C1002.1 U1001.4(VCC_3V0) ; also sheet 1,2,11
+3V3 [+3V3]: C1012.1 R1012.2 U1011.5(V+) U1021.5(V+) ; also sheet 1,2,3,4,5,6,11
AD_VCTCXO: R1021.2 U1021.1(OUT) ; also sheet 1
GND [GND]: C1001.2 C1002.2 C1011.2 C1012.2 R1011.1 U1001.2(GND) U1011.2(V-) U1021.2(V-) ; also sheet 1,2,3,4,5,6,7,8,9,11,12
TCXO_20MHZ: R1013.2 ; also sheet 1
TRSH: C1011.1 R1011.2 R1012.1 U1011.4(-IN)
VC_OP_FB: R1021.1 U1021.4(-IN)
XO_AMP: R1013.1 U1011.1(OUT)
XO_DRV: U1001.3(OUT) U1011.3(+IN)
XO_LP: C1001.1 R1001.2 R1002.1 U1021.3(+IN)
XO_VC: R1002.2 U1001.1(VC)
XO_VC_PWM: R1001.1 ; also sheet 1

### Notes on the sheet
- f_LP = 1 Hz, PWM min. 100 Hz
- 580mV

## Sheet 11 of 12: Power
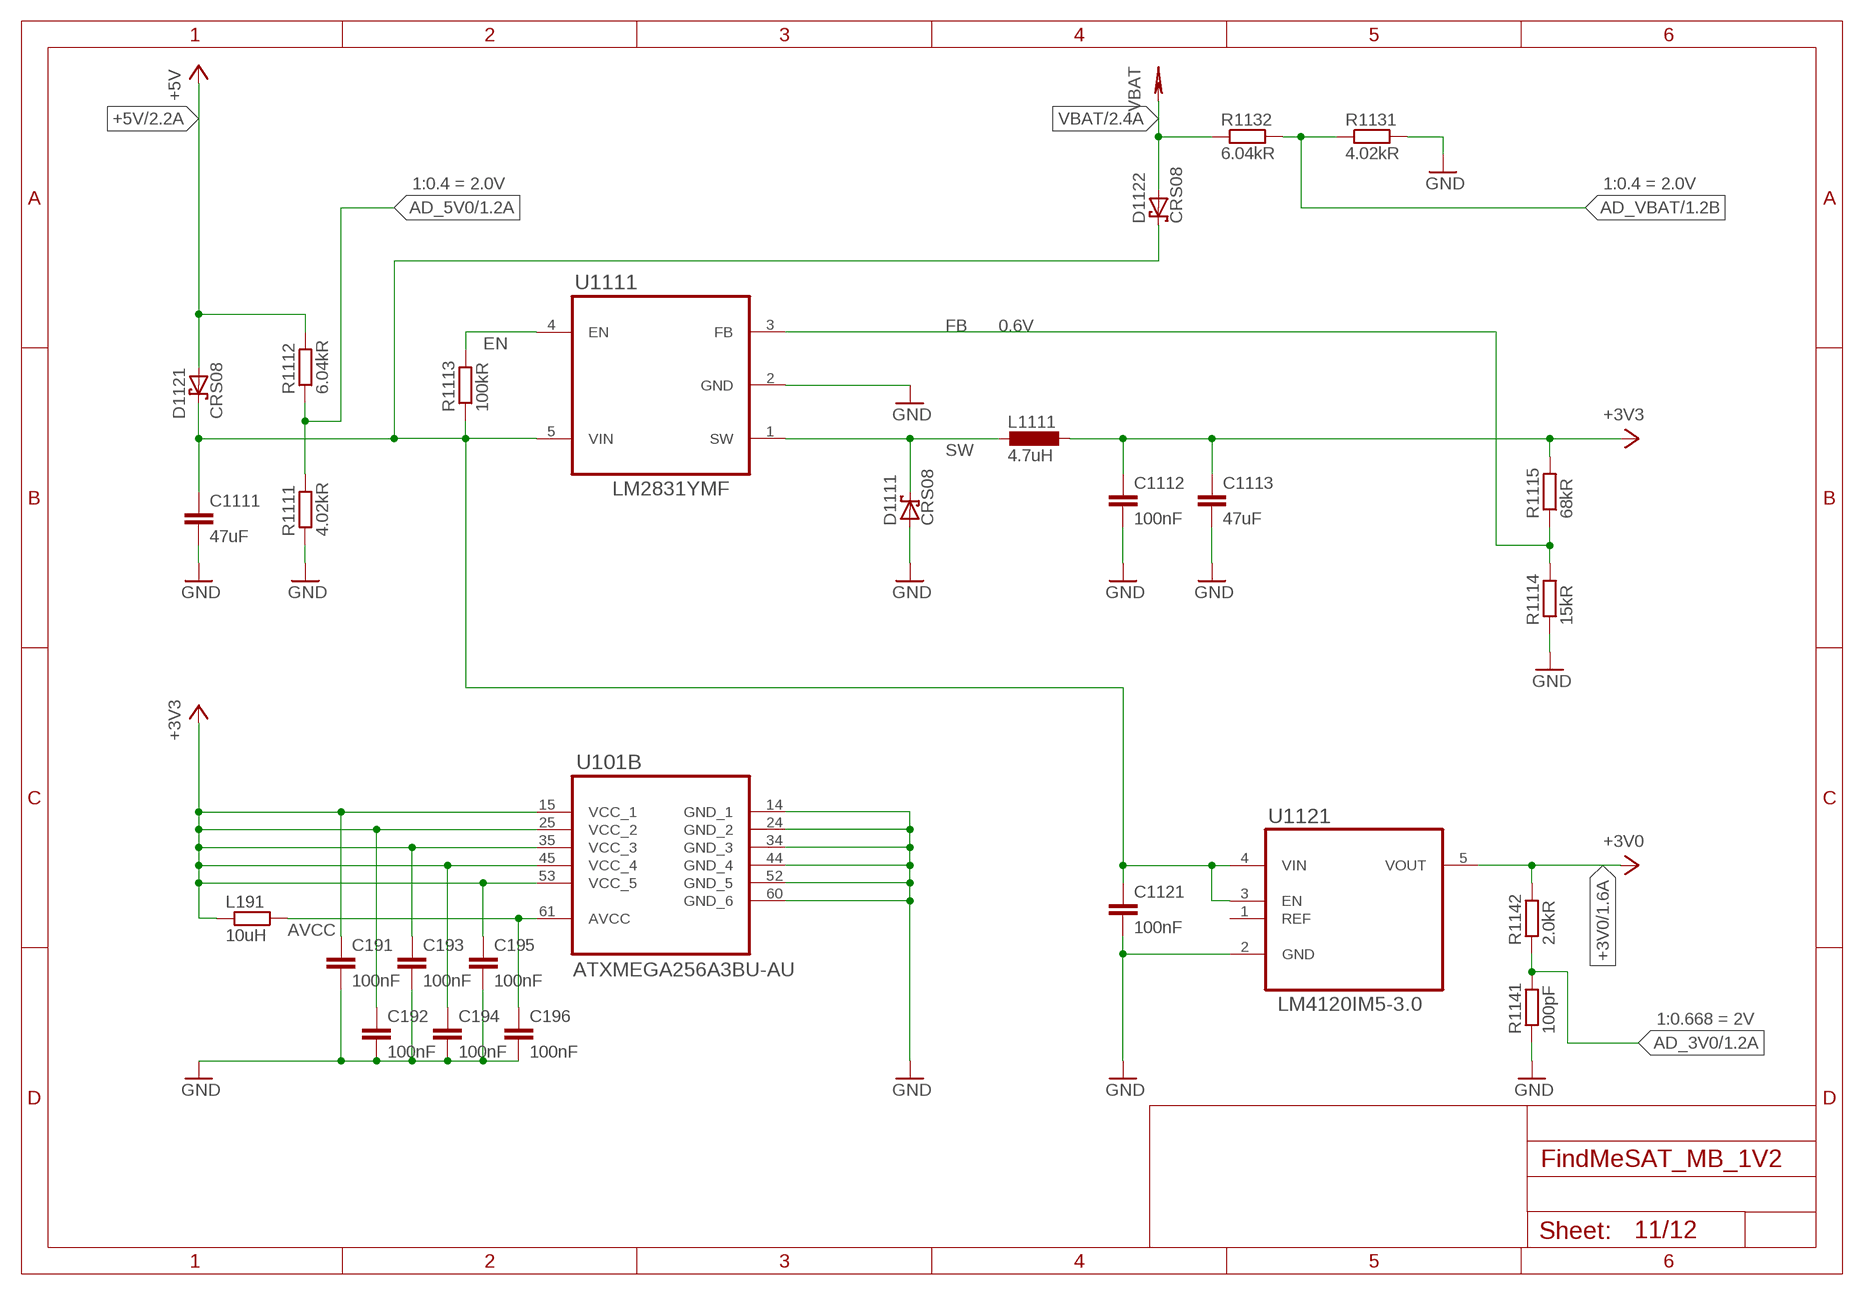
[diagram p10: schematic, sheet 11]

### Parts
C191  100nF  C-EUC0603  [C0603]
C192  100nF  C-EUC0603  [C0603]
C193  100nF  C-EUC0603  [C0603]
C194  100nF  C-EUC0603  [C0603]
C195  100nF  C-EUC0603  [C0603]
C196  100nF  C-EUC0603  [C0603]
C1111  47uF  C-EUC0805  [C0805]
C1112  100nF  C-EUC0603  [C0603]
C1113  47uF  C-EUC0805  [C0805]
C1121  100nF  C-EUC0603  [C0603]
D1111  CRS08  [SOD80C]
D1121  CRS08  [SOD80C]
D1122  CRS08  [SOD80C]
L191  10uH  R-EU_R0603  [R0603]
L1111  4.7uH  L-EUL5650M  [L5650M]
R1111  4.02kR  R-EU_R0603  [R0603]
R1112  6.04kR  R-EU_R0603  [R0603]
R1113  100kR  R-EU_R0603  [R0603]
R1114  15kR  R-EU_R0603  [R0603]
R1115  68kR  R-EU_R0603  [R0603]
R1131  4.02kR  R-EU_R0603  [R0603]
R1132  6.04kR  R-EU_R0603  [R0603]
R1141  100pF  R-EU_R0603  [R0603]
R1142  2.0kR  R-EU_R0603  [R0603]
U1111  LM2831YMF  [SOT95P280X145-5N]
U1121  LM4120IM5-3.0  [SOT95P285X120-5N]

### Nets
+3V0: R1142.2 U1121.5(VOUT) ; also sheet 1,2,10
+3V3 [+3V3]: C191.1 C192.1 C193.1 C194.1 C195.1 C1112.1 C1113.1 L191.2 L1111.1 R1115.2 U101.15(B:VCC_1) U101.25(B:VCC_2) U101.35(B:VCC_3) U101.45(B:VCC_4) U101.53(B:VCC_5) ; also sheet 1,2,3,4,5,6,10
+5V [pwrA5]: D1121.A R1112.2 ; also sheet 1,2,7
AD_3V0: R1141.2 R1142.1 ; also sheet 1
AD_5V0: R1111.2 R1112.1 ; also sheet 1
AD_VBAT: R1131.1 R1132.2 ; also sheet 1
AVCC: C196.1 L191.1 U101.61(B:AVCC)
EN: R1113.2 U1111.4(EN)
FB: R1114.2 R1115.1 U1111.3(FB)
GND [GND]: C191.2 C192.2 C193.2 C194.2 C195.2 C196.2 C1111.2 C1112.2 C1113.2 C1121.2 D1111.A R1111.1 R1114.1 R1131.2 R1141.1 U101.14(B:GND_1) U101.24(B:GND_2) U101.34(B:GND_3) U101.44(B:GND_4) U101.52(B:GND_5) U101.60(B:GND_6) U1111.2(GND) U1121.2(GND) ; also sheet 1,2,3,4,5,6,7,8,9,10,12
SW: D1111.C L1111.2 U1111.1(SW)
VBAT [pwr2A]: D1122.A R1132.1 ; also sheet 2,9
VIN [pwrA5]: C1111.1 C1121.1 D1121.C D1122.C R1113.1 U1111.5(VIN) U1121.3(EN) U1121.4(VIN)
Unconnected: U1121.1(REF)

### Notes on the sheet
- 1:0.4 = 2.0V | 1:0.4 = 2.0V
- 0.6V
- 1:0.668 = 2V

## Sheet 12 of 12: Mounting
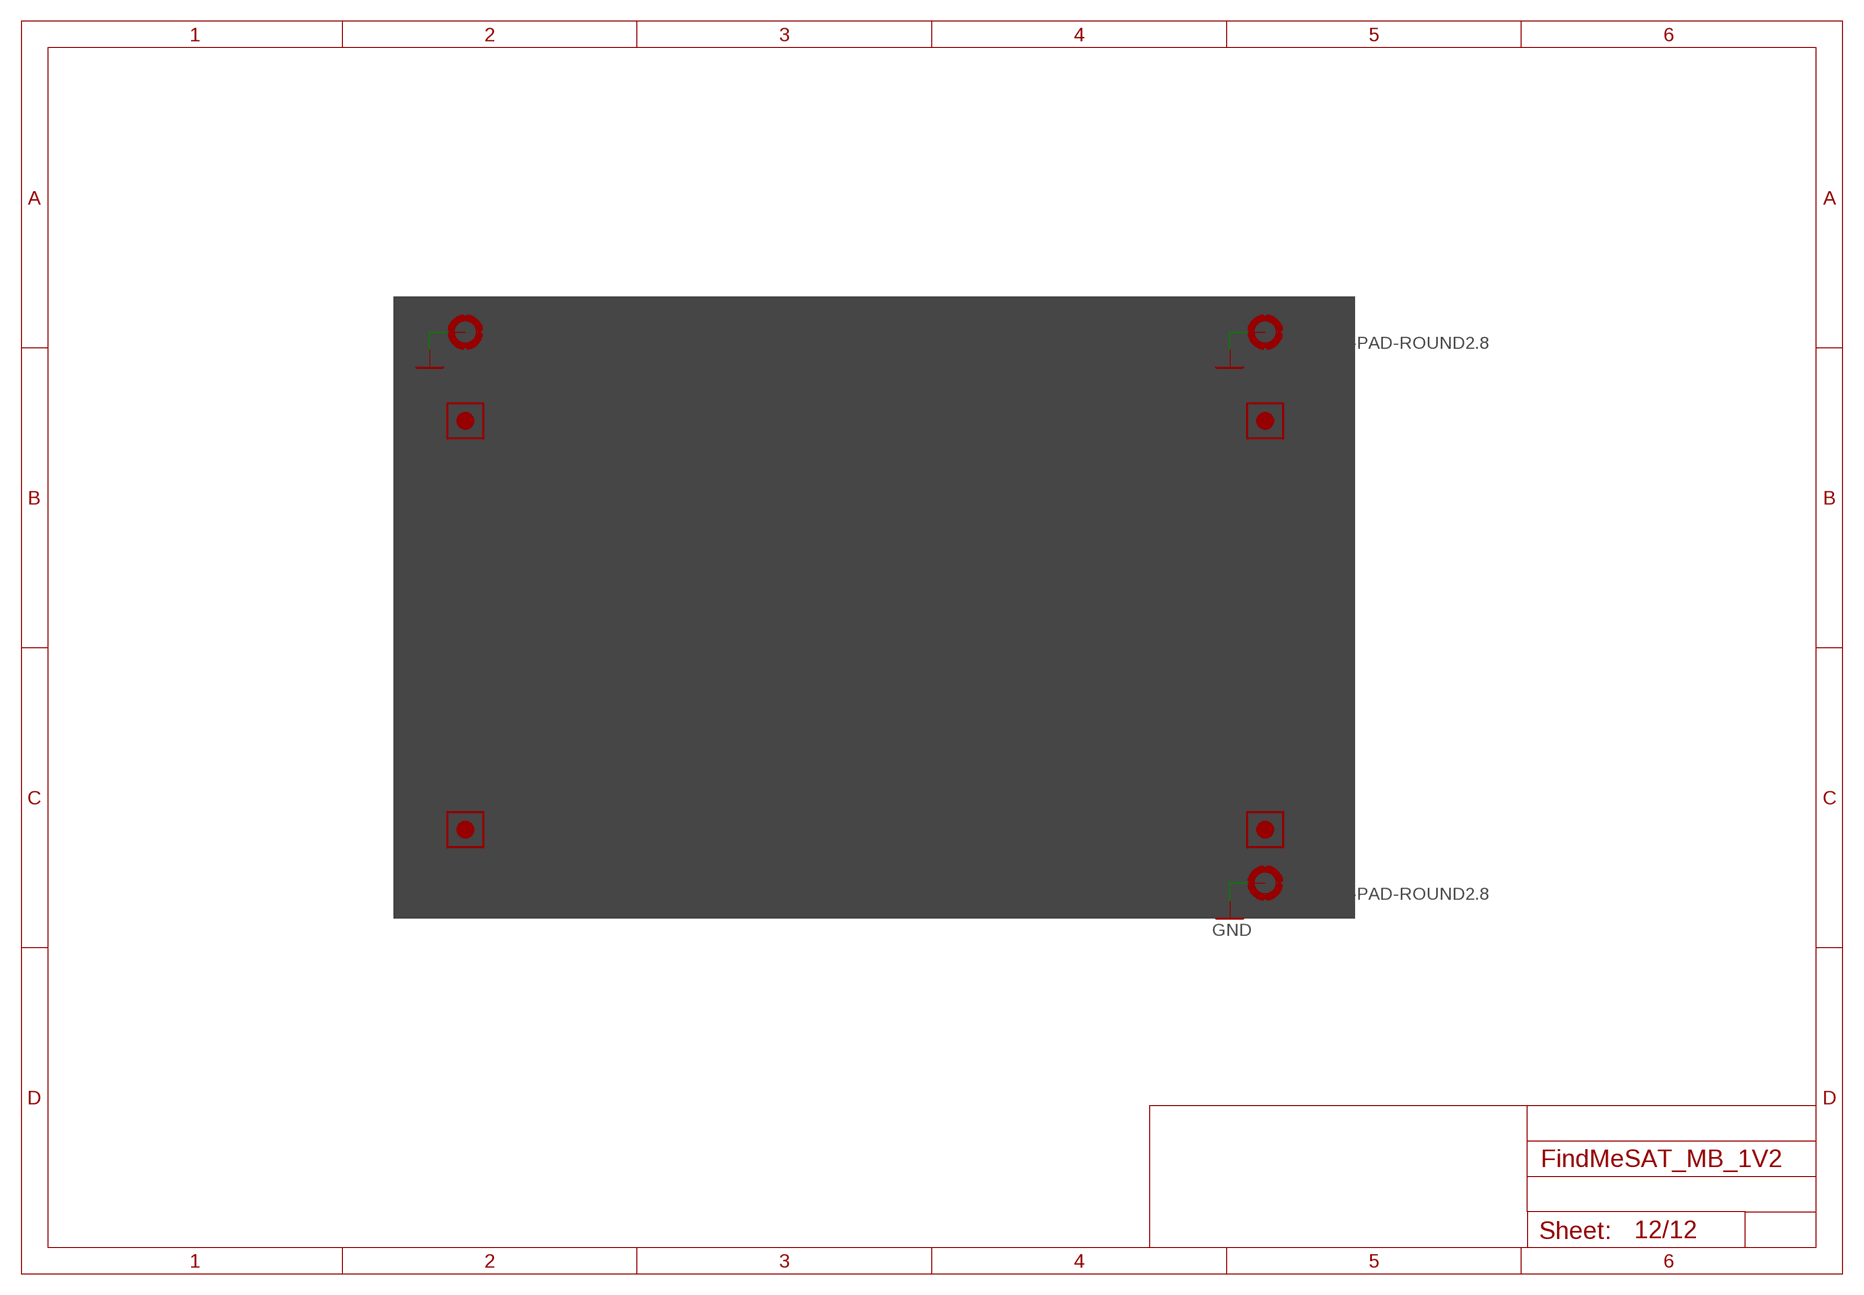
[diagram p11: schematic, sheet 12]

### Parts
FM1201  FIDUCIAL_MARK_1MM  [FIDUCIAL_MARK_1MM]
FM1202  FIDUCIAL_MARK_1MM  [FIDUCIAL_MARK_1MM]
FM1203  FIDUCIAL_MARK_1MM  [FIDUCIAL_MARK_1MM]
FM1204  FIDUCIAL_MARK_1MM  [FIDUCIAL_MARK_1MM]
H1201  MOUNT-PAD-ROUND2.8  [2,8-PAD]
H1203  MOUNT-PAD-ROUND2.8  [2,8-PAD]
H1204  MOUNT-PAD-ROUND2.8  [2,8-PAD]

### Nets
GND [GND]: H1201.B2,8(MOUNT) H1203.B2,8(MOUNT) H1204.B2,8(MOUNT) ; also sheet 1,2,3,4,5,6,7,8,9,10,11

## Power pins joined to a net without a drawn wire
T4: X801.T4(B:T4)

## Library data of the parts
C101 C141 C191-C196 C201 C251 C271 C272 C281 C282 C291 C292 C301 C302 C401 C501 C601 C611 C612 C681 C686 C701 C711 C712 C901 C1001 C1002 C1011 C1012 C1111-C1113 C1121 = rcl:C-EU: CAPACITOR, European symbol
D201 D721 D722 = df4iah_diode:BZX84CSMD: Z DIODE
D1111 D1121 D1122 = df4iah_diode:CRS08: SCHOTTKY BARRIER RECTIFIER
FM1201-FM1204 = df4iah_fiducial:FIDUCIAL_MARK_1MM: Fiducial Mark Diameter = 1mm, Clearance = 3R
H1201 H1203 H1204 = holes:MOUNT-PAD-ROUND: MOUNTING PAD, round
JP201 = df4iah_connector:HEADER-1X2: Header 1X2 2.54mm ISP, ...
L191 L671 L681 L682 L686 R111 R112 R131 R132 R141 R142 R151 R161-R163 R171-R173 R211 R212 R221-R224 R231-R234 R241 R251 R271 R281 R291 R301 R401 R402 R701 R721-R725 R1001 R1002 R1011-R1013 R1021 R1111-R1115 R1131 R1132 R1141 R1142 RPOLY291 RPOLY711 RPOLY901 = rcl:R-EU_: RESISTOR, European symbol
L291 L1111 = rcl:L-EU: INDUCTOR, European symbol
Q101 = df4iah_crystal:ABS07-32.768KHZ: ABRACON ABS07 32.768 kHz SMD LOW PROFILE CRYSTAL Source: http://www.abracon.com/Resonators/ABS07.pdf; FARNELL: 2467865; MANUFACTURER: ABS07-32.768KHZ-1-T
Q651 = df4iah_crystal:ABM03B-16.000MHZ: ABRACON ABM03B 16.000 MHz CERAMIC SMD CRYSTAL Source: http://www.abracon.com/Resonators/abm3b.pdf
U101 = df4iah_processors:ATXMEGA256A3BU-AU: 8/16-bit XMEGA A3BU Microcontroller,TQFP-64; MPN: ATXMEGA256A3BU-AU; OC_FARNELL: 2066305; OC_NEWARK: 68T3930; PACKAGE: TQFP-64; SUPPLIER: ATMEL
U201 = df4iah_gsm:SIM808: SIM808 GSM / GPS / BT Module
U301 = df4iah_sensors:MPU-9250: MPU-9250 9 Degree of Freedom IMU System in Package that contains MPU-6500 & AK8963 NC pin 19. 2-6 & 14-17 not internally connected. May be used for PCB trace routing. Datasheet <https://cdn.sparkfun.com/assets/learn_tutorials/5/5/0/MPU9250REV1.0.pdf> SparkFun Products: SparkFun 9DoF Razor IMU M0 <https://www.sparkfun.com/products/14001> SparkFun IMU Breakout - MPU-9250 <https://www.sparkfun.com/products/13762>
U401 = df4iah_sensors:MS5607-02BA: MS5607-02BA03 Pressure Sensor Datasheet <http://www.te.com/commerce/DocumentDelivery/DDEController?Action=srchrtrv&DocNm=MS5607-02BA03&DocType=Data+Sheet&DocLang=English> Specifications: Pin Count: 8 Dimensions: 3.0 x 5.0 x 0.95 mm Pitch: 1.25 mm
U501 = df4iah_sensors:SHT3: SHT3x-DIS - Humidity and Temperature Sensor Variant Huminity tolerance Temperature tolerance SHT30-DIS +/- 3.0% RH +/- 0.3°C @ 0°C .. 65°C SHT31-DIS +/- 2.0% RH +/- 0.3°C @ -40°C .. 90°C SHT35-DIS +/- 1.5% RH +/- 0.2°C @ -40°C .. 90°C
U601 = df4iah_rf:AX5243: AX5243 Advanced High Performance ASK and FSK Narrow-band Transceiver for 27 - 1050 MHz Range Reference: http://www.onsemi.com/PowerSolutions/product.do?id=AX5243
U1001 = df4iah_osc:CFPT-141: VCTCXO, 3.0V; MF: IQD-FREQUENCY-PRODUCTS; MPN: LFTVXO022175; OC_FARNELL: 1100745
U1011 U1021 = df4iah_opamp:OPA354: CMOS OPERATIONAL AMPLIFIERS; MPN: OPA354AIDBVT; OC_FARNELL: 1207050; OC_NEWARK: -; PACKAGE: SOT-23-5; SUPPLIER: Texas Instruments
U1111 = df4iah_powersupply:LM2831: HIGH-EFFICIENCY, SOT23 STEP-DOWN, DC-DC CONVERTER; MPN: LM2831YMF/NOPB; OC_FARNELL: 1286714; OC_NEWARK: -; PACKAGE: SOT-23-5; SUPPLIER: National Semiconductor
U1121 = df4iah_powersupply:LM4120IM5-3.0: Precision Micropower Low Dropout Voltage Reference; MPN: LM4120IM5-3.0; OC_FARNELL: 1312745; OC_NEWARK: 41K5441; PACKAGE: SOT-23-5; SUPPLIER: National Semiconductors
X111 = df4iah_connector:AVR-JTAG-10: AVR JTAG Debug/Programming Header
X121 = df4iah_connector:MOLEX_90130_2X03: Header 2X3 2.54mm Molex 90130 series
X131 X181 = df4iah_connector:HEADER-2X3: Header 2X3 2.54mm ISP, ...
X291 = df4iah_connector:MCX-J-P-X-RA-SM1: FEMALE SMA CONNECTOR Radiall
X685 = df4iah_connector:SMA_SMT_AMPHENOL-901-143: RF/COAXIAL, SMA JACK, R/A, 50OHM, THD; MPN: 901-143; OC_FARNELL: 1461631; OC_NEWARK: 51F3841; PACKAGE: RF/COAXIAL, SMA JACK, R/A, 50OHM, THD; SUPPLIER: Amphenol
X701 = df4iah_connector:USB_MICRO-B_MOLEX: USB Type Micro-B Connector Male/female and PTH/SMT variants Molex Products: Micro-USB B Receptacle, Bottom Mount, Surface Mount, with Solder Tabs, Lead-Free <http://www.molex.com/molex/products/datasheet.jsp?part=active/1050170001_IO_CONNECTORS.xml>
X801 = df4iah_connector:MICROSIM-8P_SDCARD-8P_MOLEX-104642-1610: Mikro-SIM and Mikro-SD-Cardholder 8 pins and 8 pins; MPN: MOLEX-104642-1610; OC_FARNELL: 2545018
X901 = df4iah_connector:JST_S3B-XH-A: JST S3B-XH-A shrouded header 3 circuit connections with 2.500 mm pin spacing

## Net classes
1 pwr2A: width 0.8 mm
2 R50: width 0.203 mm, clearance 0.9 mm
3 R90_USB: width 0.15 mm, clearance 0.203 mm
4 pwrA5: width 0.4 mm
5 R75: width 0.15 mm, clearance 0.203 mm
6 R110_SPI: width 0.15 mm, clearance 0.15 mm
7 +3V3: clearance 0.5 mm
8 GND: clearance 0.5 mm